# EAGLE schematic PFCEDU_V4 (EAGLE 9.1.3)
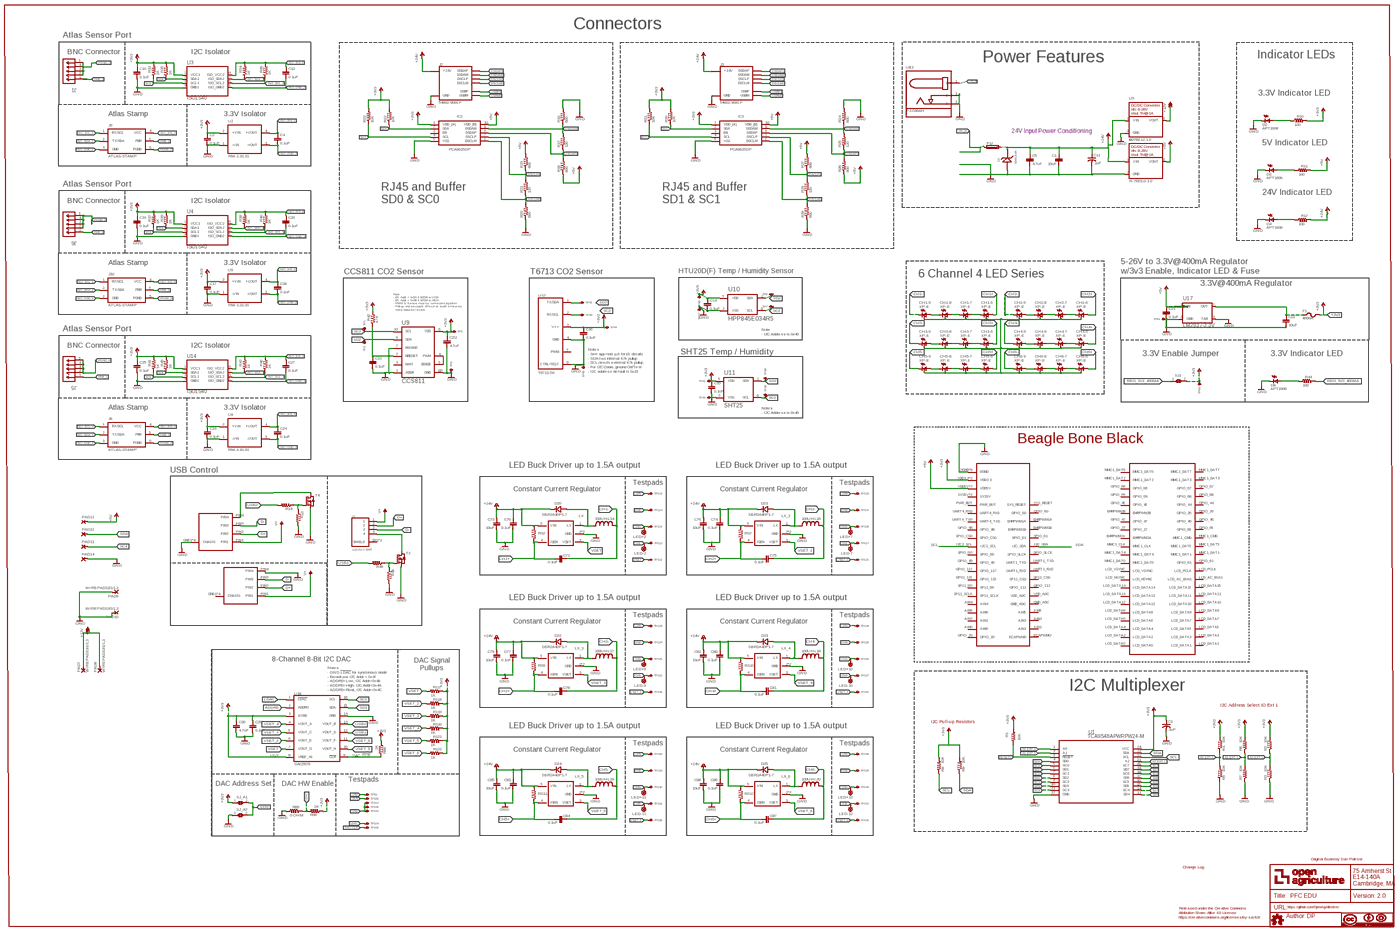
[diagram p0: schematic, sheet 1, overview]
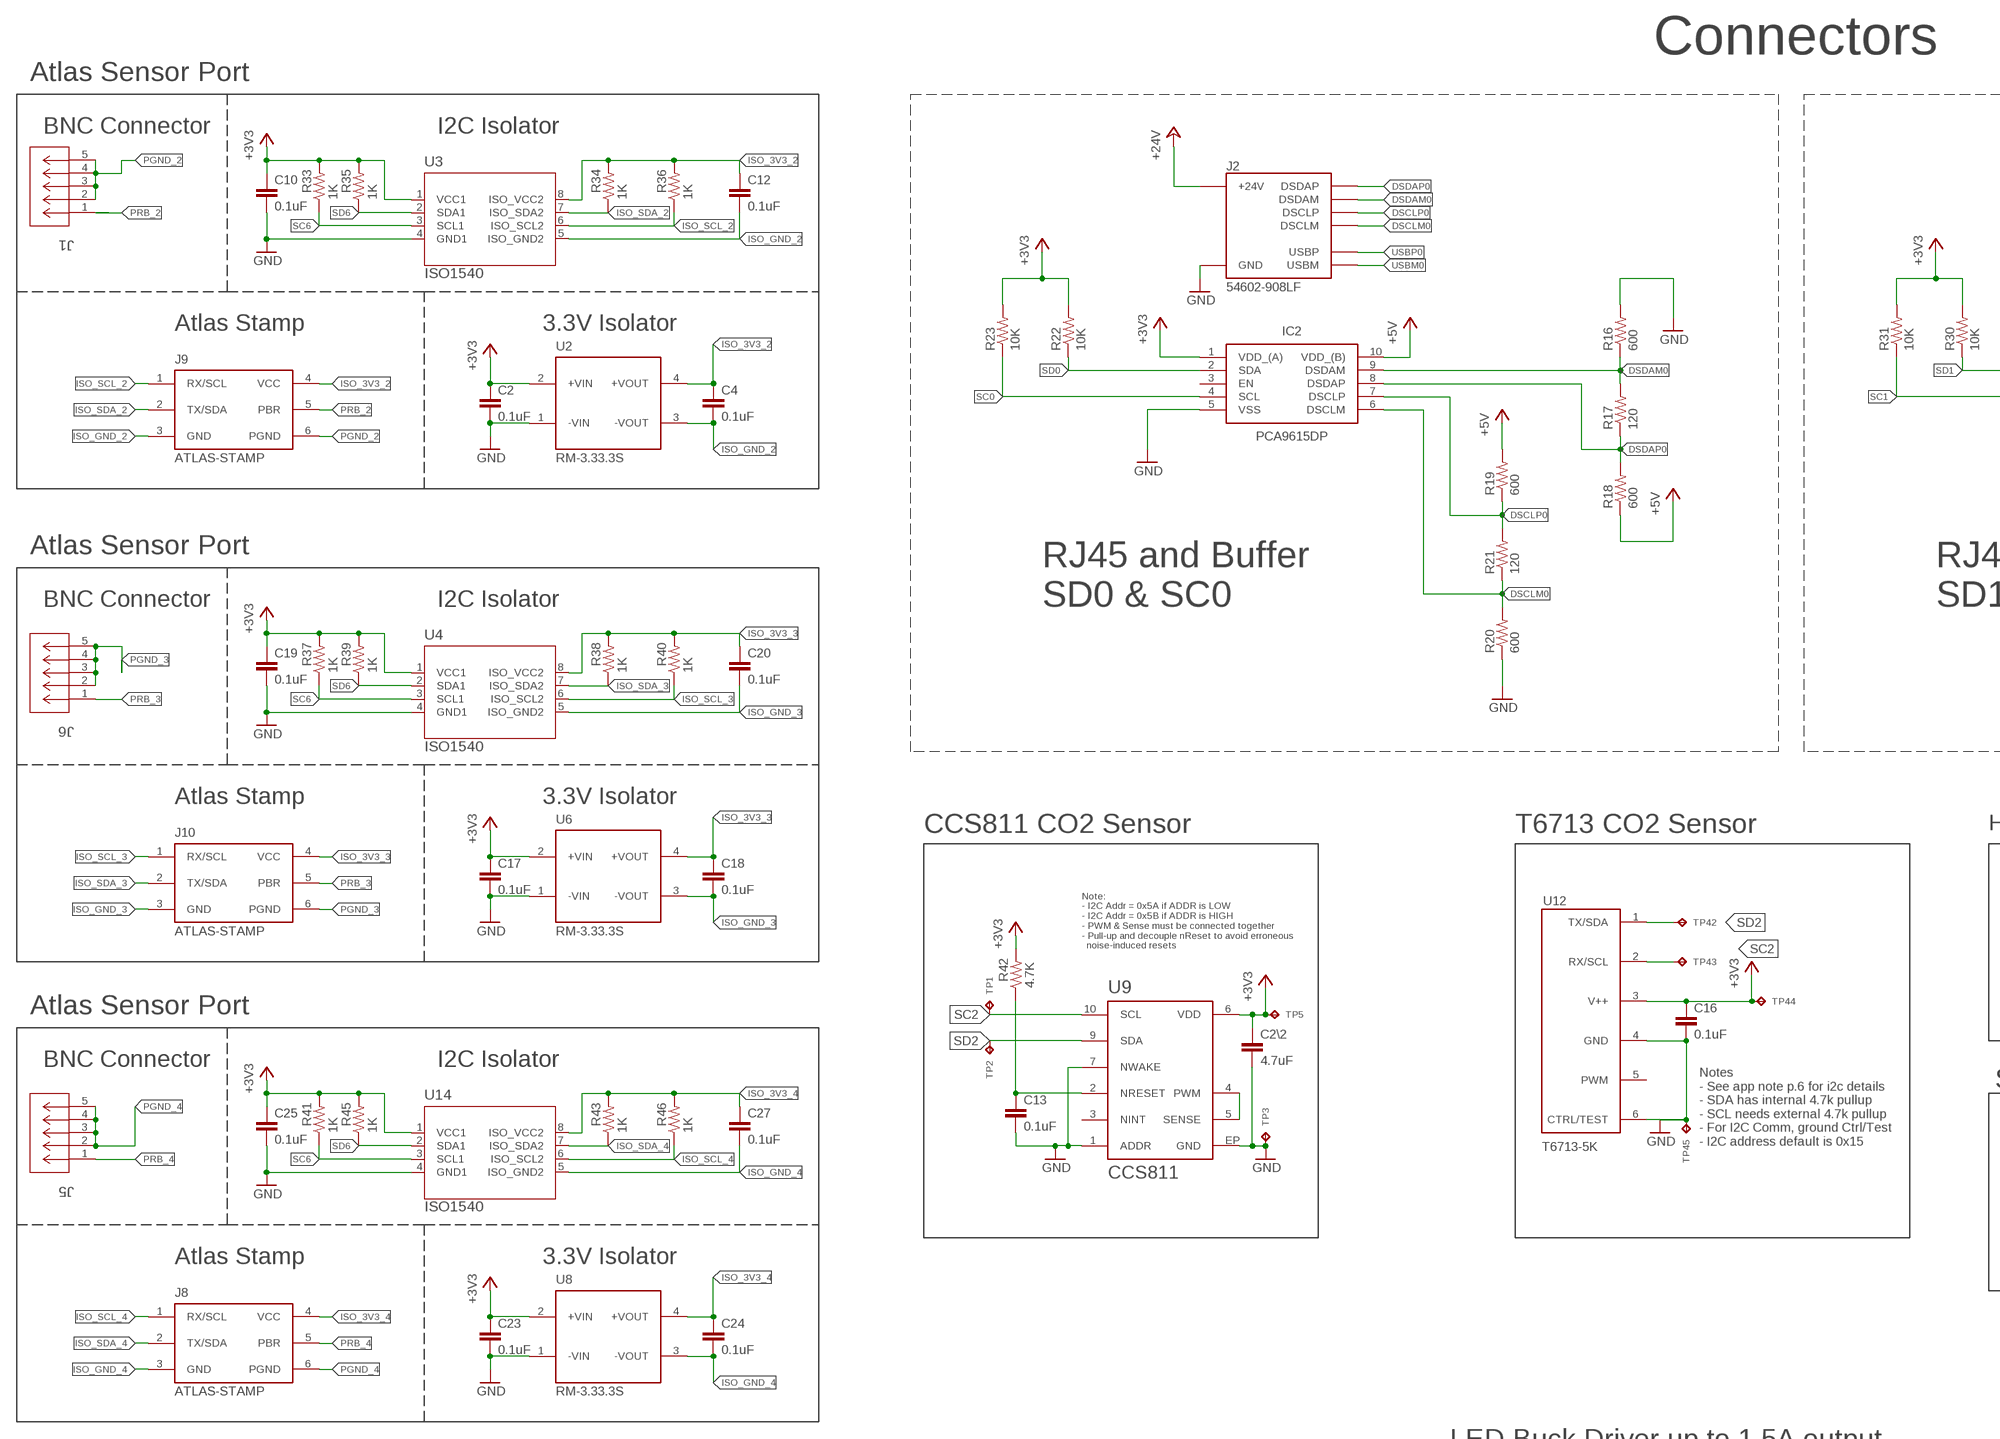
[diagram p1: schematic, sheet 1, part 1 of 4]
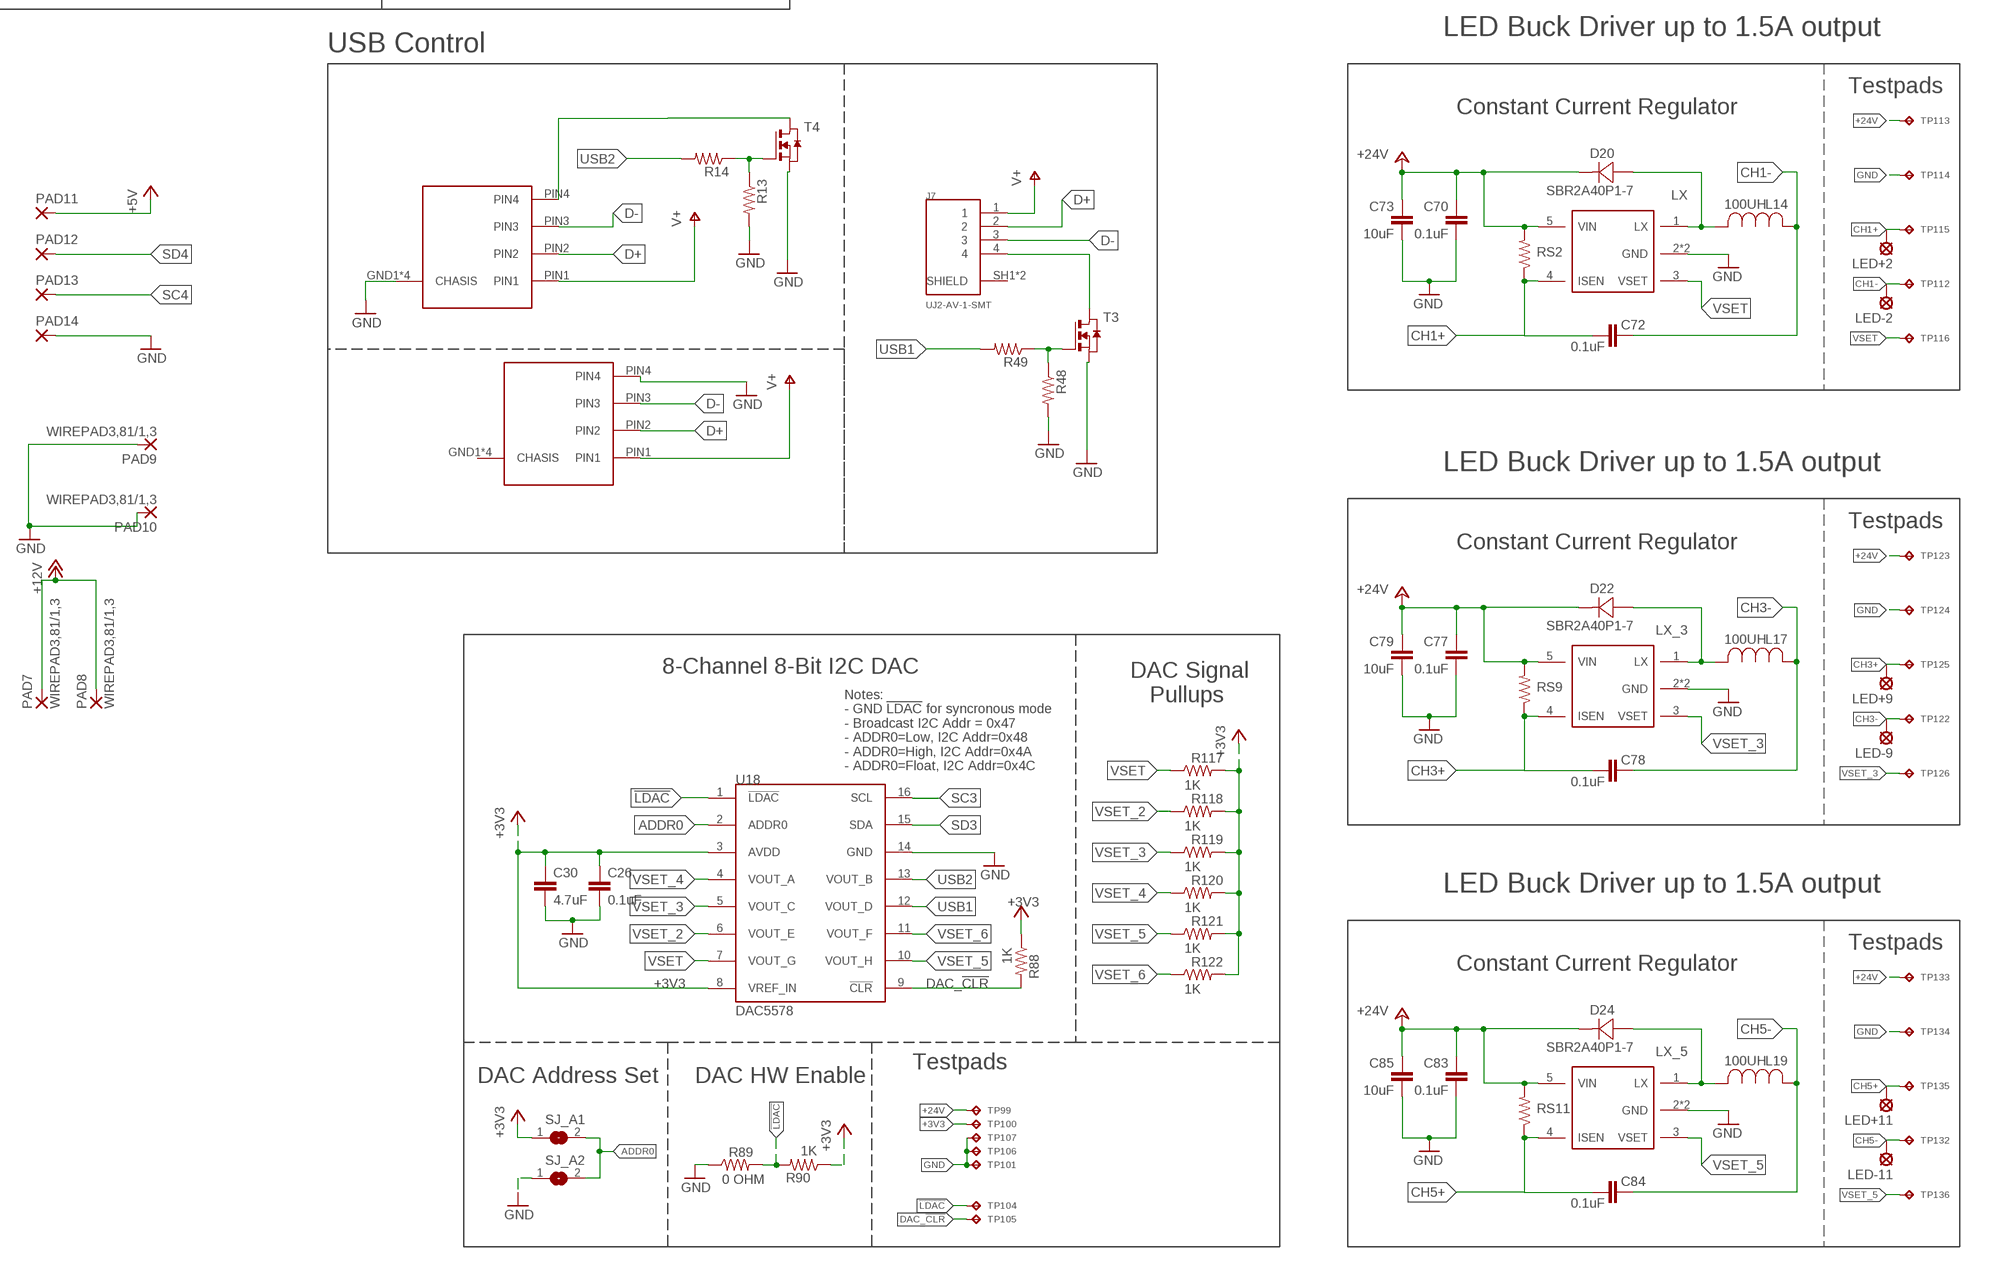
[diagram p2: schematic, sheet 1, part 2 of 4]
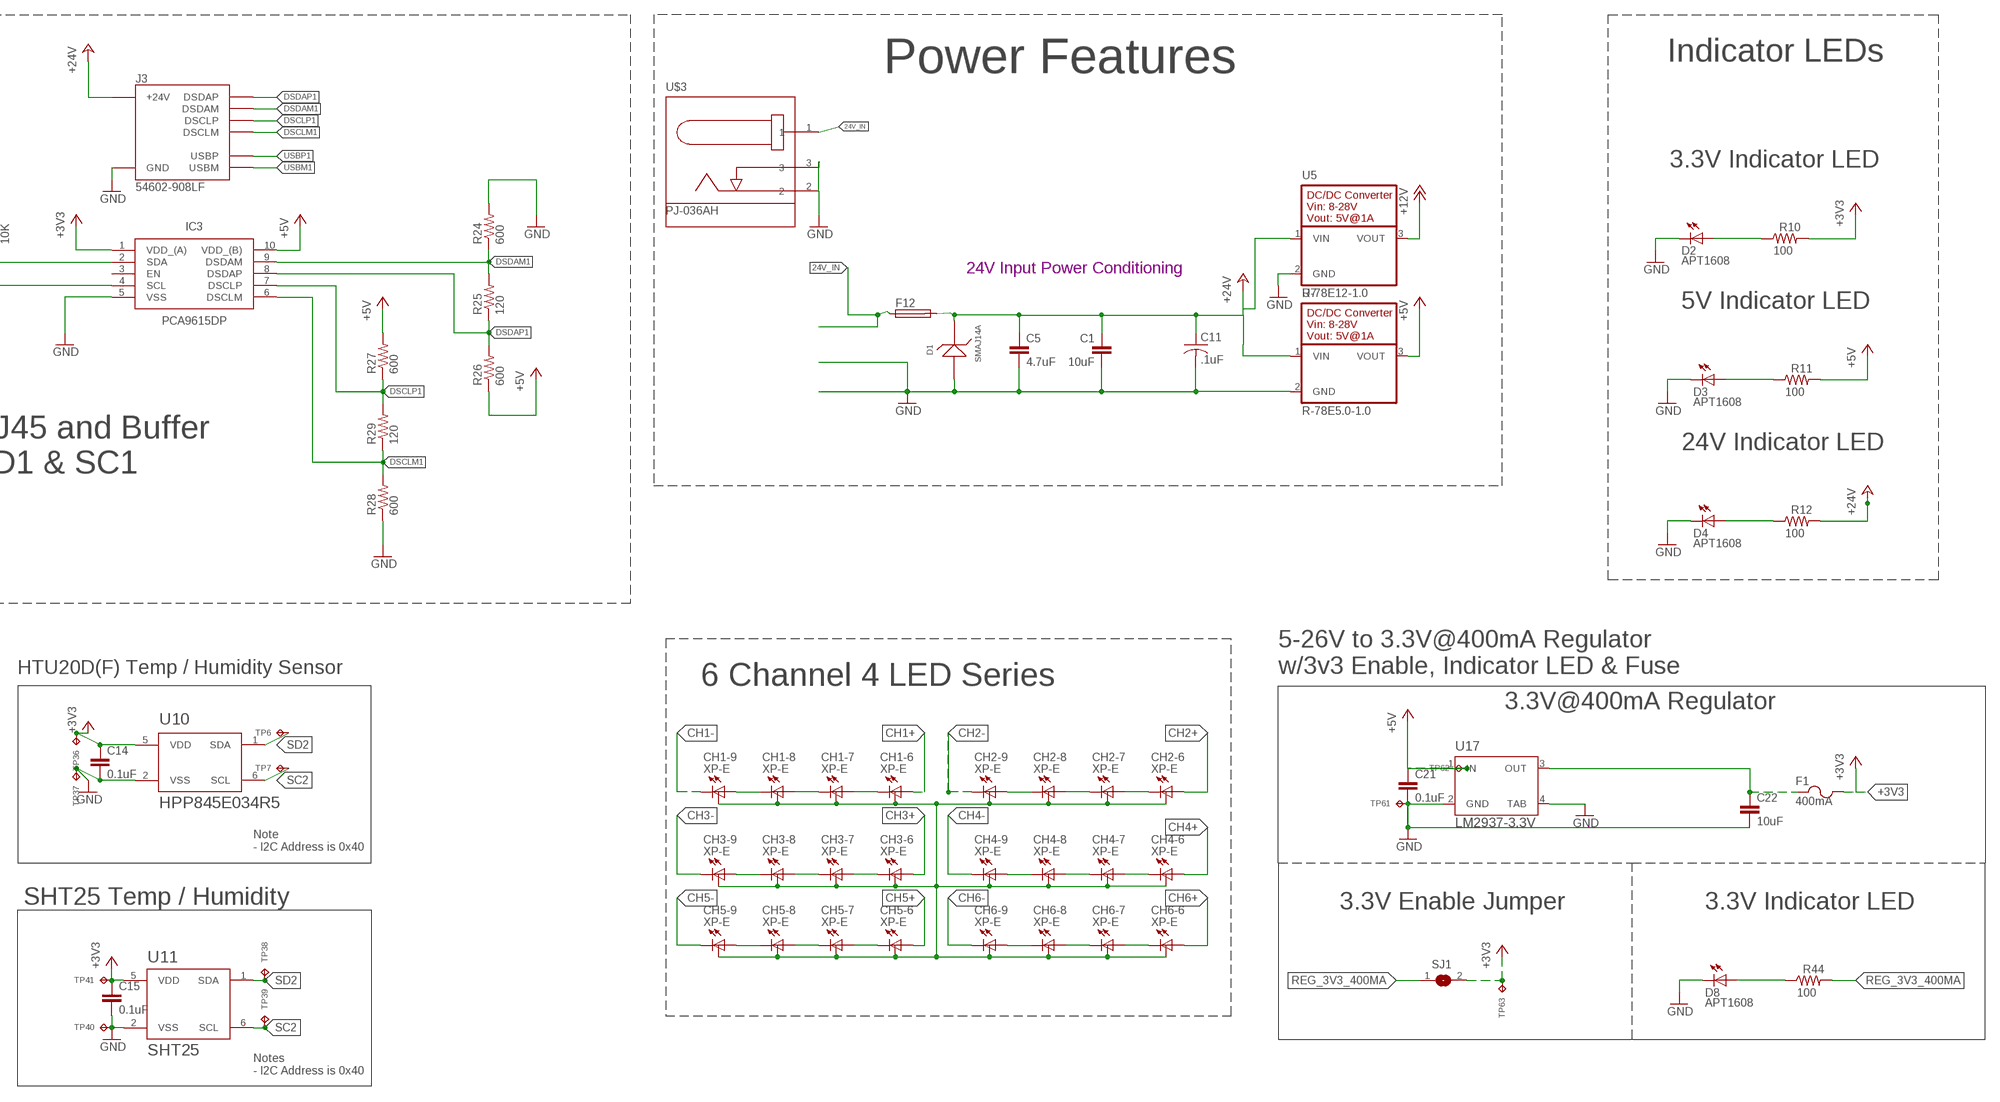
[diagram p3: schematic, sheet 1, part 3 of 4]
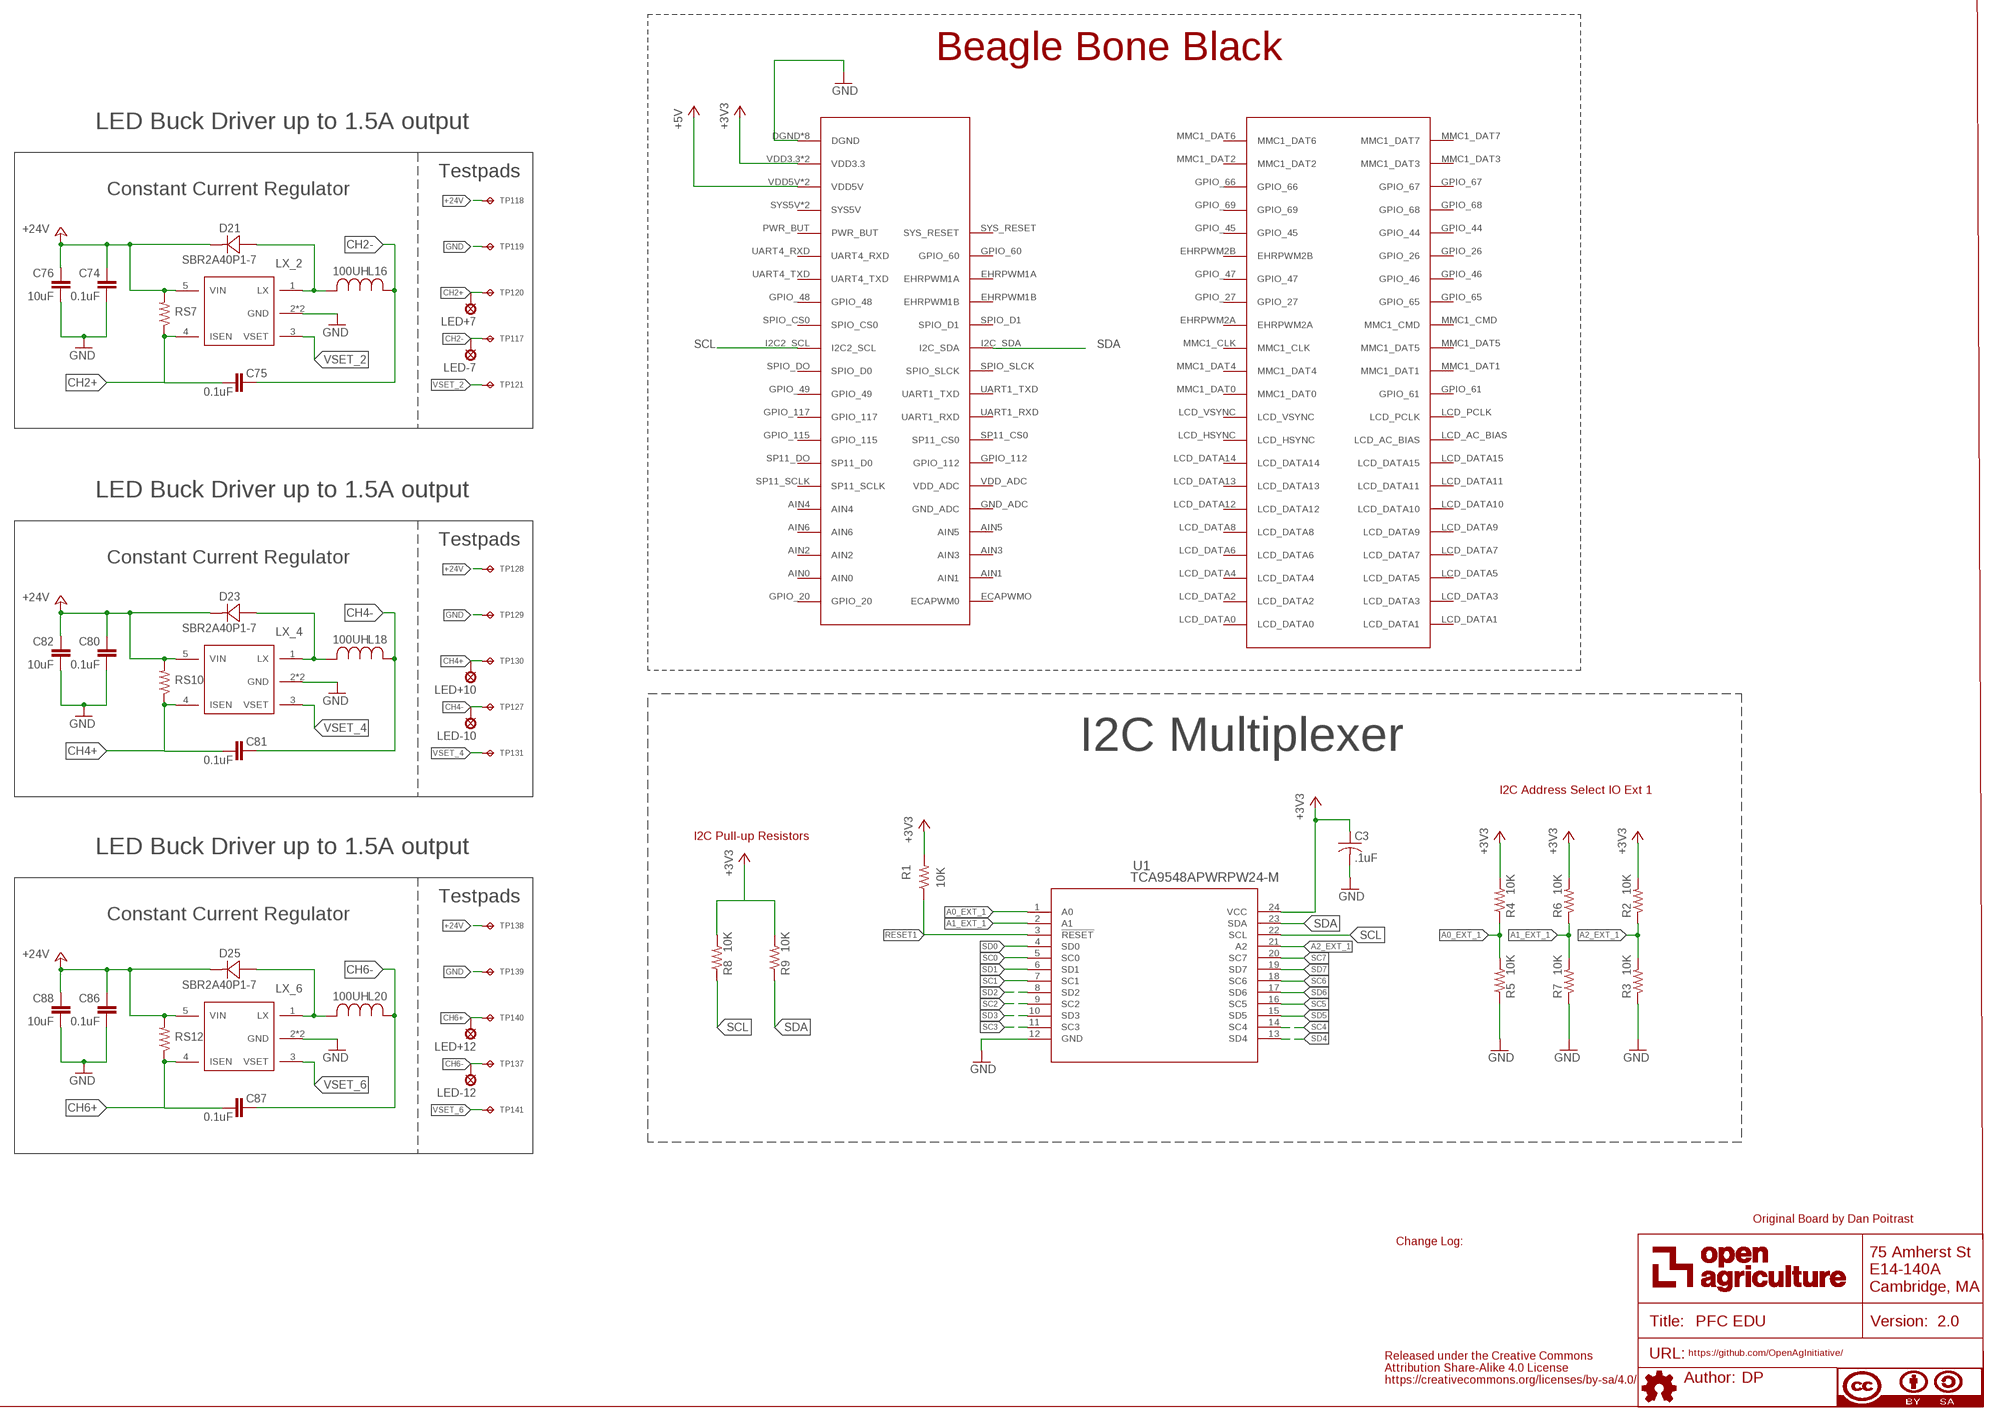
[diagram p4: schematic, sheet 1, part 4 of 4]

## Parts
ATTRIBUTES  DOCFIELD  [DOCFIELD]
C1  10uF  10UF-GMK212BBJ106KG-T  [C0805]
C2  0.1uF  0.1UF-C0603C104K5RACTU  [C0603]
C2\2  4.7uF  4.7UF-CL21A475KBQNNNE  [C0805]
C3  .1uF  C-USC0603  [C0603@1]
C4  0.1uF  0.1UF-C0603C104K5RACTU  [C0603]
C5  4.7uF  4.7UF-CL21A475KBQNNNE  [C0805]
C10  0.1uF  0.1UF-C0603C104K5RACTU  [C0603]
C11  .1uF  C-USC0603  [C0603@1]
C12  0.1uF  0.1UF-C0603C104K5RACTU  [C0603]
C13  0.1uF  0.1UF-C0603C104K5RACTU  [C0603]
C14  0.1uF  0.1UF-C0603C104K5RACTU  [C0603]
C15  0.1uF  0.1UF-C0603C104K5RACTU  [C0603]
C16  0.1uF  0.1UF-C0603C104K5RACTU  [C0603]
C17  0.1uF  0.1UF-C0603C104K5RACTU  [C0603]
C18  0.1uF  0.1UF-C0603C104K5RACTU  [C0603]
C19  0.1uF  0.1UF-C0603C104K5RACTU  [C0603]
C20  0.1uF  0.1UF-C0603C104K5RACTU  [C0603]
C21  0.1uF  0.1UF-C0603C104K5RACTU  [C0603]
C22  10uF  10UF-GMK212BBJ106KG-T  [C0805]
C23  0.1uF  0.1UF-C0603C104K5RACTU  [C0603]
C24  0.1uF  0.1UF-C0603C104K5RACTU  [C0603]
C25  0.1uF  0.1UF-C0603C104K5RACTU  [C0603]
C26  0.1uF  0.1UF-C0603C104K5RACTU  [C0603]
C27  0.1uF  0.1UF-C0603C104K5RACTU  [C0603]
C30  4.7uF  4.7UF-CL21A475KBQNNNE  [C0805]
C70  0.1uF  0.1UF-C0603C104K5RACTU  [C0603]
C72  0.1uF  0.1UF-C0603C104K5RACTU  [C0603]
C73  10uF  10UF-GMK212BBJ106KG-T  [C0805]
C74  0.1uF  0.1UF-C0603C104K5RACTU  [C0603]
C75  0.1uF  0.1UF-C0603C104K5RACTU  [C0603]
C76  10uF  10UF-GMK212BBJ106KG-T  [C0805]
C77  0.1uF  0.1UF-C0603C104K5RACTU  [C0603]
C78  0.1uF  0.1UF-C0603C104K5RACTU  [C0603]
C79  10uF  10UF-GMK212BBJ106KG-T  [C0805]
C80  0.1uF  0.1UF-C0603C104K5RACTU  [C0603]
C81  0.1uF  0.1UF-C0603C104K5RACTU  [C0603]
C82  10uF  10UF-GMK212BBJ106KG-T  [C0805]
C83  0.1uF  0.1UF-C0603C104K5RACTU  [C0603]
C84  0.1uF  0.1UF-C0603C104K5RACTU  [C0603]
C85  10uF  10UF-GMK212BBJ106KG-T  [C0805]
C86  0.1uF  0.1UF-C0603C104K5RACTU  [C0603]
C87  0.1uF  0.1UF-C0603C104K5RACTU  [C0603]
C88  10uF  10UF-GMK212BBJ106KG-T  [C0805]
CH1-6  XP-E  LED_W/THERM-XP-E  [CREE-XLAMP-XP-E]
CH1-7  XP-E  LED_W/THERM-XP-E  [CREE-XLAMP-XP-E]
CH1-8  XP-E  LED_W/THERM-XP-E  [CREE-XLAMP-XP-E]
CH1-9  XP-E  LED_W/THERM-XP-E  [CREE-XLAMP-XP-E]
CH2-6  XP-E  LED_W/THERM-XP-E  [CREE-XLAMP-XP-E]
CH2-7  XP-E  LED_W/THERM-XP-E  [CREE-XLAMP-XP-E]
CH2-8  XP-E  LED_W/THERM-XP-E  [CREE-XLAMP-XP-E]
CH2-9  XP-E  LED_W/THERM-XP-E  [CREE-XLAMP-XP-E]
CH3-6  XP-E  LED_W/THERM-XP-E  [CREE-XLAMP-XP-E]
CH3-7  XP-E  LED_W/THERM-XP-E  [CREE-XLAMP-XP-E]
CH3-8  XP-E  LED_W/THERM-XP-E  [CREE-XLAMP-XP-E]
CH3-9  XP-E  LED_W/THERM-XP-E  [CREE-XLAMP-XP-E]
CH4-6  XP-E  LED_W/THERM-XP-E  [CREE-XLAMP-XP-E]
CH4-7  XP-E  LED_W/THERM-XP-E  [CREE-XLAMP-XP-E]
CH4-8  XP-E  LED_W/THERM-XP-E  [CREE-XLAMP-XP-E]
CH4-9  XP-E  LED_W/THERM-XP-E  [CREE-XLAMP-XP-E]
CH5-6  XP-E  LED_W/THERM-XP-E  [CREE-XLAMP-XP-E]
CH5-7  XP-E  LED_W/THERM-XP-E  [CREE-XLAMP-XP-E]
CH5-8  XP-E  LED_W/THERM-XP-E  [CREE-XLAMP-XP-E]
CH5-9  XP-E  LED_W/THERM-XP-E  [CREE-XLAMP-XP-E]
CH6-6  XP-E  LED_W/THERM-XP-E  [CREE-XLAMP-XP-E]
CH6-7  XP-E  LED_W/THERM-XP-E  [CREE-XLAMP-XP-E]
CH6-8  XP-E  LED_W/THERM-XP-E  [CREE-XLAMP-XP-E]
CH6-9  XP-E  LED_W/THERM-XP-E  [CREE-XLAMP-XP-E]
D1  SMAJ14A  [DO-214AC]
D2  APT1608  APT1608CGCK  [CHIPLED_0603]
D3  APT1608  APT1608CGCK  [CHIPLED_0603]
D4  APT1608  APT1608CGCK  [CHIPLED_0603]
D8  APT1608  APT1608CGCK  [CHIPLED_0603]
D20  SBR2A40P1-7  [POWERDI123]
D21  SBR2A40P1-7  [POWERDI123]
D22  SBR2A40P1-7  [POWERDI123]
D23  SBR2A40P1-7  [POWERDI123]
D24  SBR2A40P1-7  [POWERDI123]
D25  SBR2A40P1-7  [POWERDI123]
F1  400mA  0438.375WR  [0603]
F12  GSH15  [GSH15]
IC2  PCA9615DP  [SOP50P490X110-10N]
IC3  PCA9615DP  [SOP50P490X110-10N]
J1  5-1634503-1  [CONN5_5-1634503-1]
J2  54602-908LF  OPENAG-V1-RJ45PTH  [OPENAG-V1-RJ45]
J3  54602-908LF  OPENAG-V1-RJ45PTH  [OPENAG-V1-RJ45]
J5  5-1634503-1  [CONN5_5-1634503-1]
J6  5-1634503-1  [CONN5_5-1634503-1]
J7  UJ2-AV-1-SMT  [CUI_UJ2-AV-1-SMT]
J8  ATLAS-STAMP  [ATLAS-STAMP]
J9  ATLAS-STAMP  [ATLAS-STAMP]
J10  ATLAS-STAMP  [ATLAS-STAMP]
L14  100UH  100UH_BOURNES  [IND_BOURNS_SDR1307]
L16  100UH  100UH_BOURNES  [IND_BOURNS_SDR1307]
L17  100UH  100UH_BOURNES  [IND_BOURNS_SDR1307]
L18  100UH  100UH_BOURNES  [IND_BOURNS_SDR1307]
L19  100UH  100UH_BOURNES  [IND_BOURNS_SDR1307]
L20  100UH  100UH_BOURNES  [IND_BOURNS_SDR1307]
LED+2  SE14  [SE14]
LED+7  SE14  [SE14]
LED+9  SE14  [SE14]
LED+10  SE14  [SE14]
LED+11  SE14  [SE14]
LED+12  SE14  [SE14]
LED-2  SE14  [SE14]
LED-7  SE14  [SE14]
LED-9  SE14  [SE14]
LED-10  SE14  [SE14]
LED-11  SE14  [SE14]
LED-12  SE14  [SE14]
PAD7  WIREPAD3,81/1,3  [3,81/1,3]
PAD8  WIREPAD3,81/1,3  [3,81/1,3]
PAD9  WIREPAD3,81/1,3  [3,81/1,3]
PAD10  WIREPAD3,81/1,3  [3,81/1,3]
PAD11  SMD2  [SMD1,27-2,54]
PAD12  SMD2  [SMD1,27-2,54]
PAD13  SMD2  [SMD1,27-2,54]
PAD14  SMD2  [SMD1,27-2,54]
R1  10K  R-US_R0603  [R0603]
R2  10K  10KOHM-1/10W-1%(0603)0603  [0603-RES]
R3  10K  10KOHM-1/10W-1%(0603)0603  [0603-RES]
R4  10K  10KOHM-1/10W-1%(0603)0603  [0603-RES]
R5  10K  10KOHM-1/10W-1%(0603)0603  [0603-RES]
R6  10K  10KOHM-1/10W-1%(0603)0603  [0603-RES]
R7  10K  10KOHM-1/10W-1%(0603)0603  [0603-RES]
R8  10K  10KOHM-1/10W-1%(0603)0603  [0603-RES]
R9  10K  10KOHM-1/10W-1%(0603)0603  [0603-RES]
R10  100  100OHM-RC0603JR-07100RL  [RC0603N]
R11  100  100OHM-RC0603JR-07100RL  [RC0603N]
R12  100  100OHM-RC0603JR-07100RL  [RC0603N]
R13  R-US_R0805W  [R0805W]
R14  R-US_R0805W  [R0805W]
R16  600  R-US_R0603  [R0603]
R17  120  R-US_R0603  [R0603]
R18  600  R-US_R0603  [R0603]
R19  600  R-US_R0603  [R0603]
R20  600  R-US_R0603  [R0603]
R21  120  R-US_R0603  [R0603]
R22  10K  R-US_R0603  [R0603]
R23  10K  R-US_R0603  [R0603]
R24  600  R-US_R0603  [R0603]
R25  120  R-US_R0603  [R0603]
R26  600  R-US_R0603  [R0603]
R27  600  R-US_R0603  [R0603]
R28  600  R-US_R0603  [R0603]
R29  120  R-US_R0603  [R0603]
R30  10K  R-US_R0603  [R0603]
R31  10K  R-US_R0603  [R0603]
R33  1K  1K-ERJ-PB3D1001V  [RC0603N]
R34  1K  1K-ERJ-PB3D1001V  [RC0603N]
R35  1K  1K-ERJ-PB3D1001V  [RC0603N]
R36  1K  1K-ERJ-PB3D1001V  [RC0603N]
R37  1K  1K-ERJ-PB3D1001V  [RC0603N]
R38  1K  1K-ERJ-PB3D1001V  [RC0603N]
R39  1K  1K-ERJ-PB3D1001V  [RC0603N]
R40  1K  1K-ERJ-PB3D1001V  [RC0603N]
R41  1K  1K-ERJ-PB3D1001V  [RC0603N]
R42  4.7K  4.7K-RC1206JR-074K7L  [R1206]
R43  1K  1K-ERJ-PB3D1001V  [RC0603N]
R44  100  100OHM-RC0603JR-07100RL  [RC0603N]
R45  1K  1K-ERJ-PB3D1001V  [RC0603N]
R46  1K  1K-ERJ-PB3D1001V  [RC0603N]
R48  R-US_R0805W  [R0805W]
R49  R-US_R0805W  [R0805W]
R88  1K  1K-ERJ-PB3D1001V  [RC0603N]
R89  0 OHM  0OHM-RC0603JR-070RL  [RC0603N]
R90  1K  1K-ERJ-PB3D1001V  [RC0603N]
R117  1K  1K-ERJ-PB3D1001V  [RC0603N]
R118  1K  1K-ERJ-PB3D1001V  [RC0603N]
R119  1K  1K-ERJ-PB3D1001V  [RC0603N]
R120  1K  1K-ERJ-PB3D1001V  [RC0603N]
R121  1K  1K-ERJ-PB3D1001V  [RC0603N]
R122  1K  1K-ERJ-PB3D1001V  [RC0603N]
RS2  6.34 ohm  6.3OHM-RC0805FR-076R34L  [R0805]
RS7  6.34 ohm  6.3OHM-RC0805FR-076R34L  [R0805]
RS9  6.34 ohm  6.3OHM-RC0805FR-076R34L  [R0805]
RS10  6.34 ohm  6.3OHM-RC0805FR-076R34L  [R0805]
RS11  6.34 ohm  6.3OHM-RC0805FR-076R34L  [R0805]
RS12  6.34 ohm  6.3OHM-RC0805FR-076R34L  [R0805]
SJ1  SOLDERJUMPERREFLOW_NOPASTE  [SJ1]
SJ_A1  SOLDERJUMPERREFLOW_NOPASTE  [SJ1]
SJ_A2  SOLDERJUMPERREFLOW_NOPASTE  [SJ1]
T3  NMOSSOT23  [SOT-23]
T4  NMOSSOT23  [SOT-23]
TP1  TPTP06R  [TP06R]
TP2  TPTP06R  [TP06R]
TP3  TPTP06R  [TP06R]
TP5  TPTP06R  [TP06R]
TP6  TPTP06R  [TP06R]
TP7  TPTP06R  [TP06R]
TP36  TPTP06R  [TP06R]
TP37  TPTP06R  [TP06R]
TP38  TPTP06R  [TP06R]
TP39  TPTP06R  [TP06R]
TP40  TPTP06R  [TP06R]
TP41  TPTP06R  [TP06R]
TP42  TPTP06R  [TP06R]
TP43  TPTP06R  [TP06R]
TP44  TPTP06R  [TP06R]
TP45  TPTP06R  [TP06R]
TP61  TPTP06R  [TP06R]
TP62  TPTP06R  [TP06R]
TP63  TPTP06R  [TP06R]
TP99  TPTP04R  [TP04R]
TP100  TPTP04R  [TP04R]
TP101  TPTP04R  [TP04R]
TP104  TPTP04R  [TP04R]
TP105  TPTP04R  [TP04R]
TP106  TPTP04R  [TP04R]
TP107  TPTP04R  [TP04R]
TP112  TPTP06R  [TP06R]
TP113  TPTP06R  [TP06R]
TP114  TPTP06R  [TP06R]
TP115  TPTP06R  [TP06R]
TP116  TPTP06R  [TP06R]
TP117  TPTP06R  [TP06R]
TP118  TPTP06R  [TP06R]
TP119  TPTP06R  [TP06R]
TP120  TPTP06R  [TP06R]
TP121  TPTP06R  [TP06R]
TP122  TPTP06R  [TP06R]
TP123  TPTP06R  [TP06R]
TP124  TPTP06R  [TP06R]
TP125  TPTP06R  [TP06R]
TP126  TPTP06R  [TP06R]
TP127  TPTP06R  [TP06R]
TP128  TPTP06R  [TP06R]
TP129  TPTP06R  [TP06R]
TP130  TPTP06R  [TP06R]
TP131  TPTP06R  [TP06R]
TP132  TPTP06R  [TP06R]
TP133  TPTP06R  [TP06R]
TP134  TPTP06R  [TP06R]
TP135  TPTP06R  [TP06R]
TP136  TPTP06R  [TP06R]
TP137  TPTP06R  [TP06R]
TP138  TPTP06R  [TP06R]
TP139  TPTP06R  [TP06R]
TP140  TPTP06R  [TP06R]
TP141  TPTP06R  [TP06R]
U1  TCA9548APWRPW24-M  [PW24-M]
U2  RM-3.33.3S  RM3.33.3S  [RM3.33.3S-SIP4]
U3  ISO1540  ISO1540DR  [D8]
U4  ISO1540  ISO1540DR  [D8]
U5  R-78E12-1.0  R-78E5.0-1.0  [R-78E5.0-1.0]
U6  RM-3.33.3S  RM3.33.3S  [RM3.33.3S-SIP4]
U7  R-78E5.0-1.0  [R-78E5.0-1.0]
U8  RM-3.33.3S  RM3.33.3S  [RM3.33.3S-SIP4]
U9  CCS811  [CCS811]
U10  HPP845E034R5  [HTU20D(F)]
U11  SHT25  [SHT2X]
U12  T6713-5K  [T6713]
U14  ISO1540  ISO1540DR  [D8]
U17  LM2937-3.3V  LM2937IMP-3.3/NOPB  [MP04A]
U18  DAC5578  DAC5578SPW  [TSSOP16]
U$3  PJ-036AH  BARREL-JACK-PJ-036AH-SMT-TR  [BARREL-JACK-PJ-036AH]
U$4  BBB_SMD  [23PINHEADERSMD]
U$5  USB_RIGHT  [USB_RIGHT]
U$6  USB_RIGHT  [USB_RIGHT]
U$25  AL8861  [AL8861]
U$26  AL8861  [AL8861]
U$27  AL8861  [AL8861]
U$28  AL8861  [AL8861]
U$29  AL8861  [AL8861]
U$30  AL8861  [AL8861]

## Nets
24V_IN: F12.1 U$3.1
!LDAC!: R89.2 R90.2 TP104.1(TP) U18.1(!LDAC!)
+3V3: C2.1 C2\2.1 C3.1 C10.1 C14.1 C15.1 C16.1 C17.1 C19.1 C23.1 C25.1 C26.1 C30.1 F1.2 IC2.1(VDD_(A)) IC3.1(VDD_(A)) R1.2 R2.2 R4.2 R6.2 R8.2 R9.2 R10.2 R22.2 R23.2 R30.2 R31.2 R33.2 R35.2 R37.2 R39.2 R41.2 R42.2 R45.2 R88.1 R90.1 R117.2 R118.2 R119.2 R120.2 R121.2 R122.2 SJ1.2 SJ_A1.1 TP5.TP TP36.TP TP41.TP TP44.TP TP63.TP TP100.1(TP) U1.24(VCC) U2.2(+VIN) U3.1(VCC1) U4.1(VCC1) U6.2(+VIN) U8.2(+VIN) U9.6(VDD) U10.5(VDD) U11.5(VDD) U12.3(V++) U14.1(VCC1) U18.3(AVDD) U18.8(VREF_IN) U$4.VDD3.3 U$4.VDD3.31(VDD3.3)
+5V: C21.1 IC2.10(VDD_(B)) IC3.10(VDD_(B)) PAD11.1(P) R11.2 R18.1 R19.2 R26.1 R27.2 TP62.TP U7.3(VOUT) U17.1(IN) U$4.VDD5V U$4.VDD5V1(VDD5V)
+12V: PAD7.1(P) PAD8.1(P) U5.3(VOUT)
+24V: C1.1 C5.1 C11.1 C70.1 C73.1 C74.1 C76.1 C77.1 C79.1 C80.1 C82.1 C83.1 C85.1 C86.1 C88.1 D1.C D20.- D21.- D22.- D23.- D24.- D25.- F12.2 J2.24V(6)(+24V) J3.24V(6)(+24V) R12.2 RS2.2 RS7.2 RS9.2 RS10.2 RS11.2 RS12.2 TP99.1(TP) TP113.TP TP118.TP TP123.TP TP128.TP TP133.TP TP138.TP U5.1(VIN) U7.1(VIN) U$25.5(VIN) U$26.5(VIN) U$27.5(VIN) U$28.5(VIN) U$29.5(VIN) U$30.5(VIN)
A0_EXT_1: R4.1 R5.2 U1.1(A0)
A1_EXT_1: R6.1 R7.2 U1.2(A1)
A2_EXT_1: R2.1 R3.2 U1.21(A2)
ADDR0: SJ_A1.2 SJ_A2.2 U18.2(ADDR0)
CH1+: C72.2 CH1-6.A CH1-6.A@1(A) LED+2.MP RS2.1 TP115.TP U$25.4(ISEN)
CH1-: C72.1 CH1-9.C CH1-9.C@1(C) L14.2 LED-2.MP TP112.TP
CH2+: C75.2 CH2-6.A CH2-6.A@1(A) LED+7.MP RS7.1 TP120.TP U$26.4(ISEN)
CH2-: C75.1 CH2-9.C CH2-9.C@1(C) L16.2 LED-7.MP TP117.TP
CH3+: C78.2 CH3-6.A CH3-6.A@1(A) LED+9.MP RS9.1 TP125.TP U$27.4(ISEN)
CH3-: C78.1 CH3-9.C CH3-9.C@1(C) L17.2 LED-9.MP TP122.TP
CH4+: C81.2 CH4-6.A CH4-6.A@1(A) LED+10.MP RS10.1 TP130.TP U$28.4(ISEN)
CH4-: C81.1 CH4-9.C CH4-9.C@1(C) L18.2 LED-10.MP TP127.TP
CH5+: C84.2 CH5-6.A CH5-6.A@1(A) LED+11.MP RS11.1 TP135.TP U$29.4(ISEN)
CH5-: C84.1 CH5-9.C CH5-9.C@1(C) L19.2 LED-11.MP TP132.TP
CH6+: C87.2 CH6-6.A CH6-6.A@1(A) LED+12.MP RS12.1 TP140.TP U$30.4(ISEN)
CH6-: C87.1 CH6-9.C CH6-9.C@1(C) L20.2 LED-12.MP TP137.TP
D+: J7.2 U$5.PIN2 U$6.PIN2
D-: J7.3 U$5.PIN3 U$6.PIN3
DAC_!CLR!: R88.2 TP105.1(TP) U18.9(!CLR!)
DSCLM0: IC2.6(DSCLM) J2.DSCLM(5)(DSCLM) R20.2 R21.1
DSCLM1: IC3.6(DSCLM) J3.DSCLM(5)(DSCLM) R28.2 R29.1
DSCLP0: IC2.7(DSCLP) J2.DSCLP(4)(DSCLP) R19.1 R21.2
DSCLP1: IC3.7(DSCLP) J3.DSCLP(4)(DSCLP) R27.1 R29.2
DSDAM0: IC2.9(DSDAM) J2.DSDAM(2)(DSDAM) R16.1 R17.2
DSDAM1: IC3.9(DSDAM) J3.DSDAM(2)(DSDAM) R24.1 R25.2
DSDAP0: IC2.8(DSDAP) J2.DSDAP(1)(DSDAP) R17.1 R18.2
DSDAP1: IC3.8(DSDAP) J3.DSDAP(1)(DSDAP) R25.1 R26.2
GND: C1.2 C2.2 C2\2.2 C3.2 C5.2 C10.2 C11.2 C13.2 C14.2 C15.2 C16.2 C17.2 C19.2 C21.2 C22.2 C23.2 C25.2 C26.2 C30.2 C70.2 C73.2 C74.2 C76.2 C77.2 C79.2 C80.2 C82.2 C83.2 C85.2 C86.2 C88.2 D1.A D2.C D3.C D4.C D8.C IC2.5(VSS) IC3.5(VSS) J2.GND(3)(GND) J3.GND(3)(GND) PAD9.1(P) PAD10.1(P) PAD14.1(P) R3.1 R5.1 R7.1 R13.2 R16.2 R20.1 R24.2 R28.1 R48.2 R89.1 SJ_A2.1 T3.2(S) T4.2(S) TP3.TP TP37.TP TP40.TP TP45.TP TP61.TP TP101.1(TP) TP106.1(TP) TP107.1(TP) TP114.TP TP119.TP TP124.TP TP129.TP TP134.TP TP139.TP U1.12(GND) U2.1(-VIN) U3.4(GND1) U4.4(GND1) U5.2(GND) U6.1(-VIN) U7.2(GND) U8.1(-VIN) U9.1(ADDR) U9.7(NWAKE) U9.EP(GND) U10.2(VSS) U11.2(VSS) U12.4(GND) U12.6(CTRL/TEST) U14.4(GND1) U17.2(GND) U17.4(TAB) U18.14(GND) U$3.2 U$3.3 U$4.DGND U$4.DGND1(DGND) U$4.DGND2(DGND) U$4.DGND3(DGND) U$4.DGND4(DGND) U$4.DGND5(DGND) U$4.DGND6(DGND) U$4.DGND7(DGND) U$5.GND1(CHASIS) U$5.GND2(CHASIS) U$5.GND3(CHASIS) U$5.GND4(CHASIS) U$6.PIN4 U$25.2(GND) U$25.44(GND) U$26.2(GND) U$26.44(GND) U$27.2(GND) U$27.44(GND) U$28.2(GND) U$28.44(GND) U$29.2(GND) U$29.44(GND) U$30.2(GND) U$30.44(GND)
ISO_3V3_2: C4.1 C12.1 J9.4(VCC) R34.2 R36.2 U2.4(+VOUT) U3.8(ISO_VCC2)
ISO_3V3_3: C18.1 C20.1 J10.4(VCC) R38.2 R40.2 U4.8(ISO_VCC2) U6.4(+VOUT)
ISO_3V3_4: C24.1 C27.1 J8.4(VCC) R43.2 R46.2 U8.4(+VOUT) U14.8(ISO_VCC2)
ISO_GND_2: C4.2 C12.2 J9.3(GND) U2.3(-VOUT) U3.5(ISO_GND2)
ISO_GND_3: C18.2 C20.2 J10.3(GND) U4.5(ISO_GND2) U6.3(-VOUT)
ISO_GND_4: C24.2 C27.2 J8.3(GND) U8.3(-VOUT) U14.5(ISO_GND2)
ISO_SCL_2: J9.1(RX/SCL) R36.1 U3.6(ISO_SCL2)
ISO_SCL_3: J10.1(RX/SCL) R40.1 U4.6(ISO_SCL2)
ISO_SCL_4: J8.1(RX/SCL) R46.1 U14.6(ISO_SCL2)
ISO_SDA_2: J9.2(TX/SDA) R34.1 U3.7(ISO_SDA2)
ISO_SDA_3: J10.2(TX/SDA) R38.1 U4.7(ISO_SDA2)
ISO_SDA_4: J8.2(TX/SDA) R43.1 U14.7(ISO_SDA2)
LX: D20.+ L14.1 U$25.1(LX)
LX_2: D21.+ L16.1 U$26.1(LX)
LX_3: D22.+ L17.1 U$27.1(LX)
LX_4: D23.+ L18.1 U$28.1(LX)
LX_5: D24.+ L19.1 U$29.1(LX)
LX_6: D25.+ L20.1 U$30.1(LX)
N$1: R13.1 R14.1 T4.3(G)
N$2: D3.A R11.1
N$3: R48.1 R49.1 T3.3(G)
N$4: D4.A R12.1
N$5: J7.4 T3.1(D)
N$8: T4.1(D) U$5.PIN4
N$12: D2.A R10.1
N$29: CH2-8.C CH2-8.C@1(C) CH2-9.A CH2-9.A@1(A)
N$31: CH2-7.C CH2-7.C@1(C) CH2-8.A CH2-8.A@1(A)
N$32: CH2-6.C CH2-6.C@1(C) CH2-7.A CH2-7.A@1(A)
N$33: CH4-8.C CH4-8.C@1(C) CH4-9.A CH4-9.A@1(A)
N$34: CH4-7.C CH4-7.C@1(C) CH4-8.A CH4-8.A@1(A)
N$35: CH4-6.C CH4-6.C@1(C) CH4-7.A CH4-7.A@1(A)
N$36: CH6-8.C CH6-8.C@1(C) CH6-9.A CH6-9.A@1(A)
N$37: CH6-7.C CH6-7.C@1(C) CH6-8.A CH6-8.A@1(A)
N$42: U9.4(PWM) U9.5(SENSE)
N$43: C13.1 R42.1 U9.2(NRESET)
N$46: CH6-6.C CH6-6.C@1(C) CH6-7.A CH6-7.A@1(A)
N$47: CH1-8.C CH1-8.C@1(C) CH1-9.A CH1-9.A@1(A)
N$48: CH1-7.C CH1-7.C@1(C) CH1-8.A CH1-8.A@1(A)
N$81: CH1-6.C CH1-6.C@1(C) CH1-7.A CH1-7.A@1(A)
N$82: CH3-8.C CH3-8.C@1(C) CH3-9.A CH3-9.A@1(A)
N$83: CH3-7.C CH3-7.C@1(C) CH3-8.A CH3-8.A@1(A)
N$84: CH3-6.C CH3-6.C@1(C) CH3-7.A CH3-7.A@1(A)
N$85: CH5-8.C CH5-8.C@1(C) CH5-9.A CH5-9.A@1(A)
N$159: CH5-7.C CH5-7.C@1(C) CH5-8.A CH5-8.A@1(A)
N$160: CH5-6.C CH5-6.C@1(C) CH5-7.A CH5-7.A@1(A)
N$179: D8.A R44.1
N$180: C22.1 F1.1 U17.3(OUT)
PGND_2: J1.2 J1.3 J1.4 J1.5 J9.6(PGND)
PGND_3: J6.2 J6.3 J6.4 J6.5 J10.6(PGND)
PGND_4: J5.2 J5.3 J5.4 J5.5 J8.6(PGND)
PRB_2: J1.1 J9.5(PBR)
PRB_3: J6.1 J10.5(PBR)
PRB_4: J5.1 J8.5(PBR)
REG_3V3_400MA: R44.2 SJ1.1
RESET1: R1.1 U1.3(!RESET)
SC0: IC2.4(SCL) R23.1 U1.5(SC0)
SC1: IC3.4(SCL) R31.1 U1.7(SC1)
SC2: TP1.TP TP7.TP TP39.TP TP43.TP U1.9(SC2) U9.10(SCL) U10.6(SCL) U11.6(SCL) U12.2(RX/SCL)
SC3: U1.11(SC3) U18.16(SCL)
SC4: PAD13.1(P) U1.14(SC4)
SC5: U1.16(SC5)
SC6: R33.1 R37.1 R41.1 U1.18(SC6) U3.3(SCL1) U4.3(SCL1) U14.3(SCL1)
SC7: U1.20(SC7)
SCL: R8.1 U1.22(SCL) U$4.I2C2_SCL
SD0: IC2.2(SDA) R22.1 U1.4(SD0)
SD1: IC3.2(SDA) R30.1 U1.6(SD1)
SD2: TP2.TP TP6.TP TP38.TP TP42.TP U1.8(SD2) U9.9(SDA) U10.1(SDA) U11.1(SDA) U12.1(TX/SDA)
SD3: U1.10(SD3) U18.15(SDA)
SD4: PAD12.1(P) U1.13(SD4)
SD5: U1.15(SD5)
SD6: R35.1 R39.1 R45.1 U1.17(SD6) U3.2(SDA1) U4.2(SDA1) U14.2(SDA1)
SD7: U1.19(SD7)
SDA: R9.1 U1.23(SDA) U$4.I2C_SDA
T1: CH1-6.THERM CH1-7.THERM CH1-8.THERM CH1-9.THERM CH2-6.THERM CH2-7.THERM CH2-8.THERM CH2-9.THERM CH3-6.THERM CH3-7.THERM CH3-8.THERM CH3-9.THERM CH4-6.THERM CH4-7.THERM CH4-8.THERM CH4-9.THERM CH5-6.THERM CH5-7.THERM CH5-8.THERM CH5-9.THERM CH6-6.THERM CH6-7.THERM CH6-8.THERM CH6-9.THERM
USB1: R49.2 U18.12(VOUT_D)
USB2: R14.2 U18.13(VOUT_B)
USBM0: J2.USBM(8)(USBM)
USBM1: J3.USBM(8)(USBM)
USBP0: J2.USBP(7)(USBP)
USBP1: J3.USBP(7)(USBP)
V+: J7.1 U$5.PIN1 U$6.PIN1
VSET: R117.1 TP116.TP U18.7(VOUT_G) U$25.3(VSET)
VSET_2: R118.1 TP121.TP U18.6(VOUT_E) U$26.3(VSET)
VSET_3: R119.1 TP126.TP U18.5(VOUT_C) U$27.3(VSET)
VSET_4: R120.1 TP131.TP U18.4(VOUT_A) U$28.3(VSET)
VSET_5: R121.1 TP136.TP U18.10(VOUT_H) U$29.3(VSET)
VSET_6: R122.1 TP141.TP U18.11(VOUT_F) U$30.3(VSET)
Unconnected: IC2.3(EN) IC3.3(EN) J7.SH1(SHIELD) J7.SH2(SHIELD) U9.3(NINT) U12.5(PWM) U$4.AIN0 U$4.AIN1 U$4.AIN2 U$4.AIN3 U$4.AIN4 U$4.AIN5 U$4.AIN6 U$4.ECAPWMO(ECAPWM0) U$4.EHRPWM1A U$4.EHRPWM1B U$4.EHRPWM2A U$4.EHRPWM2B U$4.GND_ADC U$4.GPIO_20 U$4.GPIO_26 U$4.GPIO_27 U$4.GPIO_44 U$4.GPIO_45 U$4.GPIO_46 U$4.GPIO_47 U$4.GPIO_48 U$4.GPIO_49 U$4.GPIO_60 U$4.GPIO_61 U$4.GPIO_65 U$4.GPIO_66 U$4.GPIO_67 U$4.GPIO_68 U$4.GPIO_69 U$4.GPIO_112 U$4.GPIO_115 U$4.GPIO_117 U$4.LCD_AC_BIAS U$4.LCD_DATA0 U$4.LCD_DATA1 U$4.LCD_DATA2 U$4.LCD_DATA3 U$4.LCD_DATA4 U$4.LCD_DATA5 U$4.LCD_DATA6 U$4.LCD_DATA7 U$4.LCD_DATA8 U$4.LCD_DATA9 U$4.LCD_DATA10 U$4.LCD_DATA11 U$4.LCD_DATA12 U$4.LCD_DATA13 U$4.LCD_DATA14 U$4.LCD_DATA15 U$4.LCD_HSYNC U$4.LCD_PCLK U$4.LCD_VSYNC U$4.MMC1_CLK U$4.MMC1_CMD U$4.MMC1_DAT0 U$4.MMC1_DAT1 U$4.MMC1_DAT2 U$4.MMC1_DAT3 U$4.MMC1_DAT4 U$4.MMC1_DAT5 U$4.MMC1_DAT6 U$4.MMC1_DAT7 U$4.PWR_BUT U$4.SP11_CS0 U$4.SP11_DO(SP11_D0) U$4.SP11_SCLK U$4.SPIO_CS0 U$4.SPIO_D1 U$4.SPIO_DO(SPIO_D0) U$4.SPIO_SLCK U$4.SYS5V U$4.SYS5V1(SYS5V) U$4.SYS_RESET U$4.UART1_RXD U$4.UART1_TXD U$4.UART4_RXD U$4.UART4_TXD U$4.VDD_ADC U$6.GND1(CHASIS) U$6.GND2(CHASIS) U$6.GND3(CHASIS) U$6.GND4(CHASIS)

## Notes on the sheet
- Connectors
- Atlas Sensor Port
- BNC Connector | I2C Isolator
- Indicator LEDs
- Power Features
- 3.3V Indicator LED
- Atlas Stamp | 3.3V Isolator
- 24V Input Power Conditioning
- 5V Indicator LED
- Atlas Sensor Port
- 24V Indicator LED
- BNC Connector | I2C Isolator
- RJ45 and Buffer
  SD0 & SC0
- RJ45 and Buffer
  SD1 & SC1
- Atlas Stamp | 3.3V Isolator
- HTU20D(F) Temp / Humidity Sensor
- 5-26V to 3.3V@400mA Regulator 
  w/3v3 Enable, Indicator LED & Fuse
- CCS811 CO2 Sensor | T6713 CO2 Sensor
- 6 Channel 4 LED Series
- 3.3V@400mA Regulator
- Note:
  - I2C Addr = 0x5A if ADDR is LOW
  - I2C Addr = 0x5B if ADDR is HIGH
  - PWM & Sense must be connected together
  - Pull-up and decouple nReset to avoid erroneous
    noise-induced resets
- Atlas Sensor Port
- Note
  - I2C Address is 0x40
- BNC Connector | I2C Isolator
- SHT25 Temp / Humidity | 3.3V Enable Jumper | 3.3V Indicator LED
- Notes
  - See app note p.6 for i2c details
  - SDA has internal 4.7k pullup
  - SCL needs external 4.7k pullup
  - For I2C Comm, ground Ctrl/Test
  - I2C address default is 0x15
- Atlas Stamp | 3.3V Isolator
- Notes
  - I2C Address is 0x40
- LED Buck Driver up to 1.5A output | LED Buck Driver up to 1.5A output
- USB Control
- Testpads | Testpads
- Constant Current Regulator | Constant Current Regulator
- LED Buck Driver up to 1.5A output | LED Buck Driver up to 1.5A output
- Testpads | Testpads
- Constant Current Regulator | Constant Current Regulator
- 8-Channel 8-Bit I2C DAC
- DAC Signal 
     Pullups
- Notes:
  - GND !LDAC! for syncronous mode
  - Broadcast I2C Addr = 0x47
  - ADDR0=Low, I2C Addr=0x48
  - ADDR0=High, I2C Addr=0x4A
  - ADDR0=Float, I2C Addr=0x4C
- I2C Multiplexer
- I2C Address Select IO Ext 1
- I2C Pull-up Resistors
- LED Buck Driver up to 1.5A output | LED Buck Driver up to 1.5A output
- Testpads | Testpads
- Constant Current Regulator | Constant Current Regulator
- Testpads
- DAC Address Set | DAC HW Enable
- Original Board by Dan Poitrast
- Change Log:
- Released under the Creative Commons
  Attribution Share-Alike 4.0 License
  https://creativecommons.org/licenses/by-sa/4.0/

## Library data of the parts
ATTRIBUTES = openag-frames:DOCFIELD: DOCUMENT FIELD; AUTHOR: DP; MPN: N/A; TITLE: PFC EDU; URL: https://github.com/OpenAgInitiative/; VER: 2.0
C1 C22 C73 C76 C79 C82 C85 C88 = openag-capacitors:10UF-GMK212BBJ106KG-T: CAP CER 10UF 35V X5R 0805 Description: 10µF ±10% 35V Ceramic Capacitor X5R 0805 (2012 Metric) Technical Specifications: Capacitance: 10µF Tolerance: ±10% Rated Voltage: 35V Temperature Coefficient: X5R Operating Temperature: -55°C ~ 85°C Package / Case: 0805 (2012 Metric) Datasheet(s): GMK212BBJ106KG-T Spec <http://ds.yuden.co.jp/TYCOMPAS/ut/detail.do?productNo=GMK212BBJ106KG-T&fileName=GMK212BBJ106KG-T_SS&mode=specSheetDownload> Vendor(s): Digikey: 587-4893-1-ND <https://www.digikey.com/product-detail/en/taiyo-yuden/GMK212BBJ106KG-T/587-4893-1-ND/6563736>; MANUFACTURER: Taiyo Yuden; MPN: GMK212BBJ106KG-T; VENDOR: Digikey; VLINK: https://www.digikey.com/product-detail/en/taiyo-yuden/GMK212BBJ106KG-T/587-4893-1-ND/6563736; VPN: 587-4893-1-ND
C2 C4 C10 C12-C21 C23-C27 C70 C72 C74 C75 C77 C78 C80 C81 C83 C84 C86 C87 = openag-capacitors:0.1UF-C0603C104K5RACTU: CAP CER 0.1UF 50V X7R 0603 Description: 0.1µF ±10% 50V Ceramic Capacitor X7R 0603 (1608 Metric) Technical Specifications: Capacitance: 0.1µF Tolerance: ±10% Rated Voltage: 50V Temperature Coefficient: X7R Operating Temperature: -55°C ~ 125°C Package / Case: 0603 (1608 Metric) Datasheet(s): X7R Dielectric, 6.3-250 VDC <https://search.kemet.com/component-edge/download/datasheet/C0603C104K5RACTU.pdf> Vendor(s): Digikey: 399-5089-1-ND <https://www.digikey.com/product-detail/en/kemet/C0603C104K5RACTU/399-5089-1-ND/1465623>; MANUFACTURER: Kemet; MPN: C0603C104K5RACTU; VENDOR: Digikey; VLINK: https://www.digikey.com/product-detail/en/kemet/C0603C104K5RACTU/399-5089-1-ND/1465623; VPN: 399-5089-1-ND
C2\2 C5 C30 = openag-capacitors:4.7UF-CL21A475KBQNNNE: CAP CER 4.7UF 50V X5R 0805 Description: 4.7µF ±10% 50V Ceramic Capacitor X5R 0805 (2012 Metric) Technical Specifications: Capacitance: 4.7uF Tolerance: ±10% Rated Voltage: 50V Temperature Coefficient: X5R Operating Temperature: -55°C ~ 85°C Package/Case: 0805 (2012 Metric) Datasheet(s): CL21A475KBQNNNE Characteristics <http://www.samsungsem.com/kr/front/downloadcms.do?path=/kr/support/product-search/mlcc/__icsFiles/afieldfile/2014/11/05&fileName=C_CL21A475KBQNNNE.pdf> Vendor(s): Digikey: 1276-1248-1-ND <https://www.digikey.com/product-detail/en/samsung-electro-mechanics/CL21A475KBQNNNE/1276-1248-1-ND/3889334>; MANUFACTURER: Samsung; MPN: CL21A475KBQNNNE; VENDOR: Digikey; VLINK: https://www.digikey.com/product-detail/en/samsung-electro-mechanics/CL21A475KBQNNNE/1276-1248-1-ND/3889334; VPN: 1276-1248-1-ND
C3 C11 = rcl:C-US: CAPACITOR, American symbol
CH1-6-CH1-9 CH2-6-CH2-9 CH3-6-CH3-9 CH4-6-CH4-9 CH5-6-CH5-9 CH6-6-CH6-9 = Tomaszewski:LED_W/THERM
D1 = openag-diodes:SMAJ14A: TVS DIODE 14VWM 23.2VC SMA - Littlefuse - SMAJ14A - SMAJ14ALFCT-ND Description: The SMAJ series is designed specifically to protect sensitive electronic equipment from voltage transients induced by lightning and other transient voltage events Technical Specifications: Type: Zener Voltage - Reverse Standoff (Typ): 14V Voltage - Breakdown (Min): 15.6V Voltage - Clamping (Max) @ Ipp: 23.2V Current - Peak Pulse (10/1000µs): 17.2A Operating Temperature: -55°C ~ 150°C (TJ) Mounting Type: Surface Mount Package / Case: DO-214AC, SMA Datasheet(s): SMAJ Series <http://www.littelfuse.com/~/media/electronics/datasheets/tvs_diodes/littelfuse_tvs_diode_smaj_datasheet.pdf.pdf> Vendor(s): Digikey: SMAJ14ALFCT-ND <https://www.digikey.com/product-detail/en/littelfuse-inc/SMAJ14A/SMAJ14ALFCT-ND/762486>; POPULATE: YES; VERIFIED: NO
D2-D4 D8 = openag-diodes:APT1608CGCK: LED GREEN CLEAR 0603 SMD Description: Green 570nm LED Indication - Discrete 2.1V 0603 (1608 Metric) Technical Specifications: Color: Green Lens Color: Colorless Lens Transparency: Clear Millicandela Rating: 50mcd Lens Style/Size: Rectangle with Flat Top, 1.20mm x 0.80mm Voltage - Forward (Vf) (Typ): 2.1V Current - Test: 20mA Viewing Angle: 120° Mounting Type: Surface Mount Wavelength - Dominant: 570nm Wavelength - Peak: 574nm Package / Case: 0603 (1608 Metric) Supplier Device Package: Chip LED Size / Dimension: 1.60mm L x 0.80mm W Height (Max): 0.75mm Datasheet(s): APT1608CGCK <http://www.kingbrightusa.com/images/catalog/SPEC/APT1608CGCK.pdf> Vendor(s): Digikey: 754-1116-1-ND <https://www.digikey.com/product-detail/en/kingbright/APT1608CGCK/754-1116-1-ND/1747833#>; MANUFACTURER: Kingbright; MPN: APT1608CGCK; VENDOR: Digikey; VLINK: https://www.digikey.com/product-detail/en/kingbright/APT1608CGCK/754-1116-1-ND/1747833#; VPN: 754-1116-1-ND
D20-D25 = openag-diodes:SBR2A40P1-7: DIODE SBR 40V 2A POWERDI123 Description: Diode Super Barrier 40V 2A Surface Mount PowerDI™ 123 Technical Specifications: Diode Type: Super Barrier Voltage - DC Reverse (Vr) (Max): 40V Current - Average Rectified (Io): 2A Voltage - Forward (Vf) (Max) @ If: 500mV @ 2A Speed: Standard Recovery >500ns, > 200mA (Io) Current - Reverse Leakage @ Vr: 100µA @ 40V Mounting Type: Surface Mount Package / Case: POWERDI®123 Supplier Device Package: PowerDI™ 123 Operating Temperature - Junction: -65°C ~ 150°C Base Part Number: SBR2A40 Datasheet(s): SBR2A40P1 <https://www.diodes.com/assets/Datasheets/SBR2A40P1.pdf> Vendor(s): Digikey: SBR2A40P1DITR-ND <https://www.digikey.com/product-detail/en/diodes-incorporated/SBR2A40P1-7/SBR2A40P1DITR-ND/1681825>; MANUFACTURER: Diodes Incorporated; MPN: SBR2A40P1-7; VENDOR: Digikey; VLINK: https://www.digikey.com/product-detail/en/diodes-incorporated/SBR2A40P1-7/SBR2A40P1DITR-ND/1681825; VPN: SBR2A40P1DITR-ND
F1 = openag-fuses:0438.375WR: FUSE BOARD MNT 400MA 125VAC/VDC Description: FUSE BOARD MNT 400MA 125VAC/VDC Technical Specifications: Fuse Type: Board Mount (Cartridge Style Excluded) Current Rating: 400mA Voltage Rating - AC: 125V Voltage Rating - DC: 125V Response Time: Fast Package / Case: 2-SMD, Square End Block Mounting Type: Surface Mount Breaking Capacity @ Rated Voltage: 50A Melting I²t: 0.0416 Approvals: CSA, UL Operating Temperature: -55°C ~ 125°C Size / Dimension: 0.240" L x 0.106" W x 0.106" H (6.10mm x 2.69mm x 2.69mm) DC Cold Resistance: 0.4895 Ohms Datasheet(s): 448 Series Datasheet <http://www.littelfuse.com/~/media/electronics/datasheets/fuses/littelfuse_fuse_448_datasheet.pdf.pdf> Vendor(s): Digikey: F5573CT-ND <https://www.digikey.com/product-detail/en/littelfuse-inc/0448.400MR/F5573CT-ND/3306934>; MANUFACTURER: Littlefuse Inc.; MPN: 0448.400MR; VENDOR: Digikey; VLINK: https://www.digikey.com/product-detail/en/littelfuse-inc/0448.400MR/F5573CT-ND/3306934; VPN: F5573CT-ND
F12 = fuse:GSH15: FUSE HOLDER grid 15mm, 19649 Wickmann; MPN: 64900001039; OC_FARNELL: 1271673; OC_NEWARK: 02P0318
IC2 IC3 = PCA9615DP:PCA9615DP: Buffer, ReDriver 2 Channel 400kHz 10-TSSOP Source: Datasheet <http://www.nxp.com/docs/en/data-sheet/PCA9615.pdf>; DESCRIPTION: Buffer, ReDriver 2 Channel 400kHz 10-TSSOP; HEIGHT: 1.1mm; MANUFACTURER_NAME: Nexperia; MANUFACTURER_PART_NUMBER: PCA9615DP; SUPPLIER_NAME: RS
J1 J5 J6 = openag-connectors:5-1634503-1; MANUFACTURER_PART_NUMBER: 516345031; VENDOR: TE Connectivity
J2 J3 = openag_connector:OPENAG-V1-RJ45: Amphenol FCI - 54602-908LF - CONN MOD JACK 8P8C R/A UNSHLD Description: Jack Modular Connector 8p8c (RJ45, Ethernet) 90� Angle (Right) Unshielded Cat3 Technical Specifications: Connector Type: Jack Number of Positions/Contacts: 8p8c (RJ45, Ethernet) Number of Ports: 1 Number of Rows: 1 Mounting Type: Through Hole Orientation: 90� Angle (Right) Termination: Solder Shielding: Unshielded Ratings: Cat3 Features: Board Lock LED Color: Does Not Contain LED Tab Direction: Down Contact Material: Copper Alloy Contact Finish: Gold Contact Finish Thickness: 15�in (0.38�m) Housing Material: Polyester, Glass Filled Operating Temperature: -40�C ~ 70�C Datasheet(s): 54601-x04(zzz)WPLF Drawing <http://cdn.amphenol-icc.com/media/wysiwyg/files/drawing/c-bmj-0102.pdf> Vendor(s): Digikey: 609-1046-ND <https://www.digikey.com/product-detail/en/amphenol-fci/54602-908LF/609-1046-ND/1001360>; POPULATE: YES; VERIFIED: NO
J7 = UJ2-AV-1-SMT:UJ2-AV-1-SMT: 3 µin Plating Thickness, Black Insulator, USB Jack; MANUFACTURER: CUI INC; PART_REV: 1.02; STANDARD: MANFACTURER RECOMMENDATIONS
J8-J10 = openag-connectors:ATLAS-STAMP; MPN: N/A
L14 L16-L20 = openag-inductors:100UH_BOURNES: Bourne - FIXED IND 100UH 1.9A 180 MOHM Technical Specifications: Inductance: 100uH Rated Current: 1.9A Saturation Current: 3.0A DC Resistance: 180mΩ Operating Temperature: -40° C to 125°C Datasheet(s): 100uH Bourne <http://www.bourns.com/docs/Product-Datasheets/SDR1307.pdf> Vendors: Digikey: SDR1307-101KLCT-ND <https://www.digikey.com/product-detail/en/bourns-inc/SDR1307-101KL/SDR1307-101KLCT-ND/3437739>
LED+2 LED+7 LED+9-LED+12 LED-2 LED-7 LED-9-LED-12 = solpad:SE14: SOLDER PAD E1553, drill 1,4mm, distributor Buerklin, 07F820
PAD7-PAD10 = wirepad:WIREPAD: Wire PAD connect wire on PCB
PAD11-PAD14 = wirepad:SMD2: SMD PAD
R1 R13 R14 R16-R31 R48 R49 = rcl:R-US_: RESISTOR, American symbol; SPICEPREFIX: R
R2-R9 = SparkFun-Resistors:10KOHM-1/10W-1%(0603): RES-00824; PROD_ID: RES-00824
R10-R12 R44 = openag-resistors:100OHM-RC0603JR-07100RL: RES SMD 100 OHM 5% 1/10W 0603 Description: 100 Ohms ±5% 0.1W, 1/10W Chip Resistor 0603 (1608 Metric) Moisture Resistant Thick Film Technical Specifications: Resistance: 100 Ohms Tolerance: ±5% Power (Watts): 0.1W, 1/10W Composition: Thick Film Features: Moisture Resistant Temperature Coefficient: ±100ppm/°C Operating Temperature: -55°C ~ 155°C Package / Case: 0603 (1608 Metric) Supplier Device Package: 0603 Size / Dimension: 0.063" L x 0.032" W (1.60mm x 0.80mm) Height - Seated (Max): 0.022" (0.55mm) Number of Terminations: 2 Datasheet(s): Thick Film Chip Resistor Intro <http://www.yageo.com.tw/exep/pages/download/literatures/PYu-R_INT-thick_7.pdf> Chip Resistor Marking <http://www.yageo.com/exep/pages/download/literatures/PYu-R_Marking_2.pdf> RC Series, L Datasheet <http://www.yageo.com/documents/recent/PYu-RC_Group_51_RoHS_L_8.pdf> Vendor(s): Digikey: 311-100GRCT-ND <https://www.digikey.com/product-detail/en/yageo/RC0603JR-07100RL/311-100GRCT-ND/729644>; MANUFACTURER: Yageo; MPN: RC0603JR-07100RL; VENDOR: Digikey; VLINK: https://www.digikey.com/product-detail/en/yageo/RC0603JR-07100RL/311-100GRCT-ND/729644; VPN: 311-100GRCT-ND
R33-R41 R43 R45 R46 R88 R90 R117-R122 = openag-resistors:1K-ERJ-PB3D1001V: RES SMD 1K OHM 0.5% 1/5W 0603 Description: 1 kOhms ±0.5% 0.2W, 1/5W Chip Resistor 0603 (1608 Metric) Automotive AEC-Q200, Pulse Withstanding Thick Film Technical Specifications: Resistance: 1 kOhms Tolerance: ±0.5% Power: 0.2W, 1/5W Operating Temperature: -55°C ~ 155°C Package / Case: 0603 (1608 Metric) Datasheet(s): ERJ-PB3, PB6 Series, High Precision Datasheet <https://industrial.panasonic.com/cdbs/www-data/pdf/RDM0000/AOA0000C328.pdf> Vendor(s): Digikey: P20283CT-ND <https://www.digikey.com/product-detail/en/panasonic-electronic-components/ERJ-PB3D1001V/P20283CT-ND/6214538>; MANUFACTURER: Panasonic; MPN: P20283CT-ND; VENDOR: Digikey; VLINK: https://www.digikey.com/product-detail/en/panasonic-electronic-components/ERJ-PB3D1001V/P20283CT-ND/6214538; VPN: P20283CT-ND
R42 = openag-resistors:4.7K-RC1206JR-074K7L: RES SMD 4.7K OHM 5% 1/4W 1206 Description: 4.7 kOhms ±5% 0.25W, 1/4W Chip Resistor 1206 (3216 Metric) Moisture Resistant Thick Film Technical Specifications: Resistance: 4.7 kOhms Tolerance: ±5% Power (Watts): 0.25W, 1/4W Composition: Thick Film Features: Moisture Resistant Temperature Coefficient: ±100ppm/°C Operating Temperature: -55°C ~ 155°C Package / Case: 1206 (3216 Metric) Supplier Device Package: 1206 Size / Dimension: 0.122" L x 0.063" W (3.10mm x 1.60mm) Height - Seated (Max): 0.026" (0.65mm) Number of Terminations: 2 Datasheet(s): Thick Film Chip Resistor Intro <http://www.yageo.com.tw/exep/pages/download/literatures/PYu-R_INT-thick_7.pdf> Chip Resistor Marking <http://www.yageo.com/exep/pages/download/literatures/PYu-R_Marking_2.pdf> RC Series, L Datasheet <http://www.yageo.com/documents/recent/PYu-RC_Group_51_RoHS_L_8.pdf> Vendor(s): Digikey: 311-4.7KERCT-ND <https://www.digikey.com/product-detail/en/yageo/RC1206JR-074K7L/311-4.7KERCT-ND/732242>; MANUFACTURER: Yageo; MPN: RC1206JR-074K7L; VENDOR: Digikey; VLINK: https://www.digikey.com/product-detail/en/yageo/RC1206JR-074K7L/311-4.7KERCT-ND/732242; VPN: 311-4.7KERCT-ND
R89 = openag-resistors:0OHM-RC0603JR-070RL: RES SMD 0 OHM JUMPER 1/10W 0603 Description: 0 Ohms Jumper 0.1W, 1/10W Chip Resistor 0603 (1608 Metric) Moisture Resistant Thick Film Technical Specifications: Resistance: 0 Ohms Power: 0.1W, 1/10W Operating Temperature: -55°C ~ 155°C Package / Case: 0603 (1608 Metric) Datasheet(s): RC Series, L Datasheet <http://www.yageo.com/documents/recent/PYu-RC_Group_51_RoHS_L_8.pdf> Vendor(s): Digikey: 311-0.0GRCT-ND <https://www.digikey.com/product-detail/en/yageo/RC0603JR-070RL/311-0.0GRCT-ND/729622>; MANUFACTURER: Yageo; MPN: RC0603JR-070RL; VENDOR: Digikey; VLINK: https://www.digikey.com/product-detail/en/yageo/RC0603JR-070RL/311-0.0GRCT-ND/729622; VPN: 311-0.0GRCT-ND
RS2 RS7 RS9-RS12 = openag-resistors:6.3OHM-RC0805FR-076R34L: Yageo - RC0805FR-076R34L - RES SMD 6.34 OHM 1% 1/8W 0805 Description: 6.34 Ohms ±1% 0.125W, 1/8W Chip Resistor 0805 (2012 Metric) Moisture Resistant Thick Film Technical Specifications: Resistance: 6.34 Ohms Tolerance: ±1% Power: 0.125W, 1/8W Temperature Coefficient: ±200ppm/°C Operating Temperature: -55°C ~ 155°C Packaging / Case: 0805 (2012 Metric) Datasheet(s): RC Series, L Datasheet Vendor(s): Digikey: 311-6.34CRCT-ND <https://www.digikey.com/product-detail/en/yageo/RC0805FR-076R34L/311-6.34CRCT-ND/731003>; POPULATE: YES; VERIFIED: NO
SJ1 SJ_A1 SJ_A2 = openag-connectors:SOLDERJUMPER: SMD Solder JUMPER Solder the two pads together to create a connection, or remove the solder to break it. REFLOW - Use this footprint for solder paste and reflow ovens. WAVE - Use this footprint for hand-soldering (larger pads). CLOSED - Has a trace between the two pads to ensure it is closed by default. The trace needs to be cut to disable the jumper, and can be closed again by creating a solder bridge between the two pads.; MPN: N/A
T3 T4 = zetex:NMOSSOT23: MOS FET; OC_FARNELL: unknown; OC_NEWARK: unknown
TP1-TP3 TP5-TP7 TP36-TP45 TP61-TP63 TP99-TP101 TP104-TP107 TP112-TP141 = openag-testpads:TP: Test pad; MPN: N/A
U1 = OpenAG_I2C:TCA9548APWR; MANUFACTURER_PART_NUMBER: TCA9548APWR; VENDOR: TEXAS INSTRUMENTS
U2 U6 U8 = openag-isolators:RM3.33.3S: CONV DC/DC 0.25W SGL 3.3VOUT SIP Description: Isolated Module DC DC Converter 1 Output 3.3V 76mA 3V - 3.6V Input Technical Specifications: Type: Isolated Module Number of Outputs: 1 Voltage - Input (Min): 3V Voltage - Input (Max): 3.6V Voltage - Output 1: 3.3V Current - Output (Max): 76mA Power (Watts): 250mW Voltage - Isolation: 1kV Applications: ITE (Commercial) Features: SCP Operating Temperature: -40°C ~ 85°C Efficiency: 70% Mounting Type: Through Hole Package / Case: 4-SIP Module Size / Dimension: 0.45" L x 0.24" W x 0.39" H (11.5mm x 6.0mm x 10.0mm) Datasheet(s): RM Series Datasheet <https://www.recom-power.com/pdf/Econoline/RM.pdf> Vendor(s): Digikey: 945-1212-ND <https://www.digikey.com/product-detail/en/recom-power/RM-3.33.3S/945-1212-ND/2256392>; MANUFACTURER: Recom Power; MPN: RM-3.33.3S; VENDOR: Digikey; VLINK: https://www.digikey.com/product-detail/en/recom-power/RM-3.33.3S/945-1212-ND/2256392; VPN: 945-1212-ND
U3 U4 U14 = openag-isolators:ISO1540DR: DGTL ISO 2.5KV 2CH I2C 8SOIC Description: I²C Digital Isolator 2500Vrms 2 Channel 1Mbps 25kV/µs CMTI 8-SOIC (0.154", 3.90mm Width) Technical Specifications: Technology: Capacitive Coupling Type: I²C Number of Channels: 2 Channel Type: Bidirectional Voltage-Isolation: 2500Vrms Voltage - Supply: 3 V ~ 5.5 V Data Rate: 1Mbps Operating Temperature: -40°C ~ 125°C Package / Case: 8-SOIC (0.154", 3.90mm Width) Max Supply Current (3V ≤ VCC1, VCC2 ≤ 3.6V) Side 1, Side 2: 3.8mA, 3.1mA Datasheet(s): ISO154x <http://www.ti.com/lit/ds/symlink/iso1540.pdf> Vendor(s): Digikey: 296-34871-1-ND <https://www.digikey.com/product-detail/en/texas-instruments/ISO1540DR/296-34871-1-ND/3587214>; MANUFACTURER: Texas Instruments; MPN: ISO1540DR; VENDOR: Digikey; VLINK: https://www.digikey.com/product-detail/en/texas-instruments/ISO1540DR/296-34871-1-ND/3587214; VPN: 296-34871-1-ND
U5 U7 = openag-regulators:R-78E5.0-1.0: DC/DC CONVERTER 5V 5W Description: Linear Regulator Replacement DC DC Converter 1 Output 5V 1A 8V - 28V Input Technical Specifications: Type: Linear Regulator Replacement Number of Outputs: 1 Voltage - Input (Min): 8V Voltage - Input (Max): 28V Voltage - Output 1: 5V Current - Output (Max): 1A Power (Watts): 5W Applications: ITE (Commercial) Features: SCP Operating Temperature: -40°C ~ 85°C Efficiency: 91% Mounting Type: Through Hole Package / Case: 3-SIP Module Size / Dimension: 0.46" L x 0.33" W x 0.41" H (11.6mm x 8.5mm x 10.4mm) Datasheet(s): R-78E-1.0 Series Datasheet <https://www.recom-power.com/pdf/Innoline/R-78Exx-1.0.pdf> Vendor(s): Digikey: 945-2201-ND <https://www.digikey.com/product-detail/en/recom-power/R-78E5.0-1.0/945-2201-ND/4930585>; MANUFACTURER: Recom Power; MPN: R-78E5.0-1.0; VENDOR: Digikey; VLINK: https://www.digikey.com/product-detail/en/recom-power/R-78E5.0-1.0/945-2201-ND/4930585; VPN: 945-2201-ND
U9 = openag-sensors:CCS811: LOW POWER DIGITAL SENSOR FOR IND Description: Air Quality Sensor I²C Technical Specifications: Type: Air Quality Output: I²C Operating Temperature: -5°C ~ 50°C Voltage - Supply: 1.8 V ~ 3.6 V Current - Supply: 26mA Datasheet(s): CCS811 Datasheet <http://ams.com/eng/content/download/951091/2269479/471718> CCS811 Factsheet <http://ams.com/eng/content/view/download/490399> Vendor(s): Digikey: CCS811CT-ND <https://www.digikey.com/product-detail/en/ams/CCS811/CCS811CT-ND/6569300>; MANUFACTURER: ams; MPN: CCS811; VENDOR: Digikey; VLINK: https://www.digikey.com/product-detail/en/ams/CCS811/CCS811CT-ND/6569300; VPN: CCS811CT-ND
U10 = openag-sensors:HPP845E034R5: SENSOR HUMID/TEMP 3V I2C 3% SMD Description: Humidity Temperature Sensor 0 ~ 100% RH I²C ±5% RH 5s Surface Mount Technical Specifications: Sensor Type: Humidity, Temperature Humidity Range: 0 ~ 100% RH Output Type: I²C Output: 12b Accuracy: ±5% RH Response Time: 5s Voltage - Supply: 1.5 V ~ 3.6 V Mounting Type: Surface Mount Operating Temperature: -40°C ~ 125°C Datasheet(s): HTU20D(F) Series (HPP845E034Rx) Datasheet <http://www.te.com/commerce/DocumentDelivery/DDEController?Action=srchrtrv&DocNm=HPC202_5&DocType=Data+Sheet&DocLang=English> Vendor(s): Digikey: 223-1592-1-ND <https://www.digikey.com/product-detail/en/te-connectivity-measurement-specialties/HPP845E034R5/223-1592-1-ND/5416096>; MANUFACTURER: TE Connectivity Measurement Specialties; MPN: HPP845E034R5; VENDOR: Digikey; VLINK: https://www.digikey.com/product-detail/en/te-connectivity-measurement-specialties/HPP845E034R5/223-1592-1-ND/5416096; VPN: 223-1592-1-ND
U11 = openag-sensors:SHT25: SENSOR HUMI/TEMP 3V I2C 1.8% SMD Description: Humidity Temperature Sensor 0 ~ 100% RH I²C ±1.8% RH 8s Surface Mount Technical Specifications: Sensor Type: Humidity, Temperature Humidity Range: 0 ~ 100% RH Output Type: I²C Output: 12b Accuracy: ±1.8% RH Response Time: 8s Voltage - Supply: 2.1 V ~ 3.6 V Mounting Type: Surface Mount Operating Temperature: -40°C ~ 125°C Datasheet(s): SHTxx Testing Guide <https://www.sensirion.com/fileadmin/user_upload/customers/sensirion/Dokumente/2_Humidity_Sensors/Sensirion_Humidity_Sensors_Testing_Guide_V1.2.pdf> SHTxx Handling Instructions <https://www.sensirion.com/fileadmin/user_upload/customers/sensirion/Dokumente/2_Humidity_Sensors/Sensirion_Humidity_Sensors_Handling_Instructions_V4.pdf> Sensor Specification Statement <https://www.sensirion.com/fileadmin/user_upload/customers/sensirion/Dokumente/2_Humidity_Sensors/Sensirion_Humidity_Sensors_Specification_Statement_V1.pdf> SHTxx, STSxx Assembly SMD Pkgs <https://www.sensirion.com/fileadmin/user_upload/customers/sensirion/Dokumente/2_Humidity_Sensors/Sensirion_Humidity_Sensors_Handling_of_SMD_Packages_V1.pdf> SHT25 Datasheet <https://www.sensirion.com/fileadmin/user_upload/customers/sensirion/Dokumente/2_Humidity_Sensors/Sensirion_Humidity_Sensors_SHT25_Datasheet_V3.pdf> Vendor(s): Digikey: 1649-1008-1-ND <https://www.digikey.com/product-detail/en/sensirion-ag/SHT25/1649-1008-1-ND/5872290>; MANUFACTURER: Sensirion AG; MPN: SHT25; VENDOR: Digikey; VLINK: https://www.digikey.com/product-detail/en/sensirion-ag/SHT25/1649-1008-1-ND/5872290; VPN: 1649-1008-1-ND
U12 = openag-sensors:T6713-5K: CO2 MODULE 5000PPM DIFFUSION Description: CO2 Sensor I²C Technical Specifications: Type: CO2 Accuracy: ±2% Output: I²C Operating Temperature: 14 ~ 140°F (-10 ~ 60°C) Voltage - Supply: 4.5 V ~ 5.5 V Current - Supply: 200mA Datasheet(s): T6713 Series Datasheet <http://www.amphenol-sensors.com/en/component/edocman/297-telaire-t6713-series-datasheet/download?Itemid=591> Telaire CO2 Module Selection Guide <http://www.amphenol-sensors.com/en/component/edocman/488-telaire-co2-module-selection-guide-single-or-dual-channel/download?Itemid=591> T67xx Appl Note <http://www.amphenol-sensors.com/en/component/edocman/332-telaire-6700-series-application-note/download?Itemid=591> Vendor(s): Digikey: 235-1374-ND <https://www.digikey.com/product-detail/en/amphenol-advanced-sensors/T6713-5K/235-1374-ND/5027892>; MANUFACTURER: Amphenol Advanced Sensors; MPN: T6713-5K; VENDOR: Digikey; VLINK: https://www.digikey.com/product-detail/en/amphenol-advanced-sensors/T6713-5K/235-1374-ND/5027892; VPN: 235-1374-ND
U17 = openag-regulators:LM2937IMP-3.3/NOPB: IC REG LIN 3.3V 400MA SOT223-4 Description: Linear Voltage Regulator IC Positive Fixed 1 Output 3.3V 400mA SOT-223-4 Technical Specifications: Output Configuration: Positive Output Type: Fixed Number of Regulators: 1 Voltage - Input (Max): 26V Voltage - Output (Min/Fixed): 3.3V Voltage Dropout (Max): 1V @ 50mA Current - Output: 400mA Current - Quiescent (Iq): 2mA Current - Supply (Max): 1.25A Protection Features: Over Temperature, Reverse Polarity, Short Circuit Operating Temperature: -40°C ~ 85°C Mounting Type: Surface Mount Package / Case: TO-261-4, TO-261AA Supplier Device Package: SOT-223-4 Base Part Number: LM2937 Datasheet(s): LM2937-2.5, LM2937-3.3 Datasheet <http://www.ti.com/lit/ds/symlink/lm2937-2.5.pdf> Vendor(s): Digikey: LM2937IMP-3.3/NOPBCT-ND <https://www.digikey.com/product-detail/en/texas-instruments/LM2937IMP-3.3-NOPB/LM2937IMP-3.3-NOPBCT-ND/270742#>; MANUFACTURER: Texas Instruments; MPN: LM2937IMP-3.3/NOPB; VENDOR: Digikey; VLINK: https://www.digikey.com/product-detail/en/texas-instruments/LM2937IMP-3.3-NOPB/LM2937IMP-3.3-NOPBCT-ND/270742#; VPN: LM2937IMP-3.3/NOPBCT-ND
U18 = openag-dacs:DAC5578SPW: IC DAC 8BIT I2C OCTAL 16TSSOP Description: 8 Bit Digital to Analog Converter 8 16-TSSOP Technical Specifications: Number of Bits: 8 Number of D/A Converters: 8 Settling Time: 12µs (Typ) Output Type: Voltage - Buffered Differential Output: No Data Interface: I²C Reference Type: External Voltage - Supply, Analog: 2.7 V ~ 5.5 V Voltage - Supply, Digital: 2.7 V ~ 5.5 V INL/DNL (LSB): ±0.01, ±0.01 Architecture: String DAC Operating Temperature: -40°C ~ 125°C Package / Case: 16-TSSOP (0.173", 4.40mm Width) Supplier Device Package: 16-TSSOP Base Part Number: DAC5578 Datasheet(s): DAC5578,6578,7578 <http://www.ti.com/lit/ds/symlink/dac5578.pdf> Analog Signal Chain Guide <http://www.ti.com/lit/pdf/slyb174> Vendor(s): Digikey: 296-27736-5-ND <https://www.digikey.com/product-detail/en/texas-instruments/DAC5578SPW/296-27736-5-ND/2360827>; MANUFACTURER: Texas Instruments; MPN: DAC5578SPW; VENDOR: Digikey; VLINK: https://www.digikey.com/product-detail/en/texas-instruments/DAC5578SPW/296-27736-5-ND/2360827; VPN: 296-27736-5-ND
U$3 = openag-connectors:BARREL-JACK-PJ-036AH-SMT-TR: CONN PWR JACK 2X5.5MM SOLDER Description: Power Barrel Connector Jack 2.10mm ID (0.083"), 5.50mm OD (0.217") Surface Mount, Right Angle Technical Specifications: Connector Type: Jack Gender: Male Industry Recognized Mating Diameter: 2.10mm ID (0.083"), 5.50mm OD (0.217") Actual Diameter: 0.078" (2.00mm ID), 0.248" (6.30mm OD) Number of Positions/Contacts: 2 Conductors, 3 Contacts Internal Switch(s): Single Switch, Normally Closed Mounting Type: Surface Mount, Right Angle Termination: Solder Shielding: Unshielded Voltage - Rated: 24VDC Current Rating: 5A Mating Length/Depth: 0.360" (9.15mm) Contact Material - Plating: Silver Operating Temperature: -25°C ~ 85°C Housing Material: Polyamide (PA6T), Nylon 6T Contact Material: Brass; Copper Alloy Body Color: Black Datasheet(s): PJ-036AH-SMT-TR <http://www.cui.com/product/resource/digikeypdf/pj-036ah-smt-tr.pdf> Vendor(s): Digikey: CP-036AHPJCT-ND <https://www.digikey.com/product-detail/en/cui-inc/PJ-036AH-SMT-TR/CP-036AHPJCT-ND/1530994>; MANUFACTURER: CUI Inc.; MPN: PJ-036AH-SMT-TR; VENDOR: Digikey; VLINK: https://www.digikey.com/product-detail/en/cui-inc/PJ-036AH-SMT-TR/CP-036AHPJCT-ND/1530994; VPN: CP-036AHPJCT-ND
U$4 = openag-connectors:BBB_SMD
U$5 U$6 = openag-connectors:USB_RIGHT
U$25-U$30 = openag-driver-IC:AL8861: AL8861 LED Driver IC Description: IC LED DRVR REG PWM 1.5A SOT89-5 Technical Specifications: Type: IC Voltage In: 4.5V - 40V Current Out: Up to 1.5A Frequency: 1Mhz Dimming: PWM or Analog Package SOT-89-5 Operating Temperature: -40°C ~ 85°C (TA) Datasheet(s): Diodes AL8861 <https://www.mouser.com/ds/2/115/AL8861-1094677.pdf> Vendor(s): Digikey: Diodes AL8861 <https://www.digikey.com/product-detail/en/diodes-incorporated/AL8861Y-13/AL8861Y-13DICT-ND/6702378>

## Net classes
0 default: width 0.305 mm, drill 0.254 mm, clearance 0.254 mm